# Altium project ZYNQ-HS-DEV.PrjPcb (part 1 of 4)
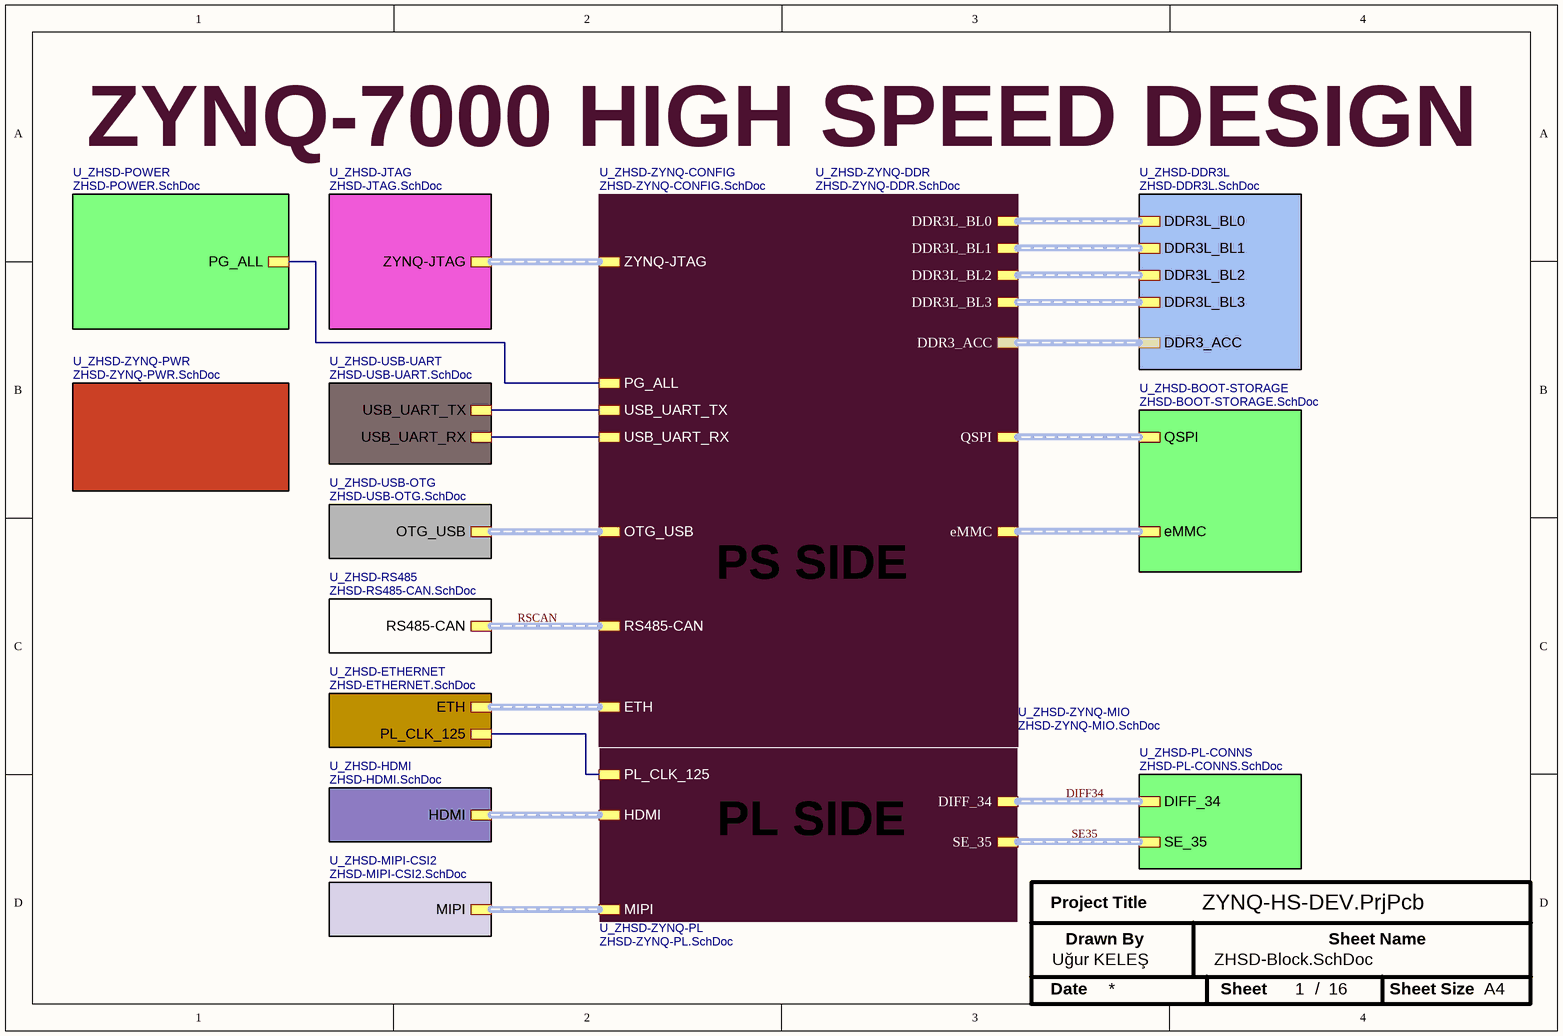
[diagram p0: ZHSD-Block.SchDoc]
16 sheets, 533 parts. Net scope: hierarchical (ports join the sheet entries above them; power ports are global).
Board file: ZYNQ-HS-DEV-PCB.PcbDoc
Sheets:
  ZHSD-Block.SchDoc
    U_ZHSD-ZYNQ-CONFIG = ZHSD-ZYNQ-CONFIG.SchDoc
    U_ZHSD-JTAG = ZHSD-JTAG.SchDoc
    U_ZHSD-ZYNQ-PWR = ZHSD-ZYNQ-PWR.SchDoc
    U_ZHSD-BOOT-STORAGE = ZHSD-BOOT-STORAGE.SchDoc
    U_ZHSD-ZYNQ-MIO = ZHSD-ZYNQ-MIO.SchDoc
    U_ZHSD-USB-OTG = ZHSD-USB-OTG.SchDoc
    U_ZHSD-ETHERNET = ZHSD-ETHERNET.SchDoc
    U_ZHSD-USB-UART = ZHSD-USB-UART.SchDoc
    U_ZHSD-RS485 = ZHSD-RS485-CAN.SchDoc
    U_ZHSD-ZYNQ-PL = ZHSD-ZYNQ-PL.SchDoc
    U_ZHSD-HDMI = ZHSD-HDMI.SchDoc
    U_ZHSD-ZYNQ-DDR = ZHSD-ZYNQ-DDR.SchDoc
    U_ZHSD-DDR3L = ZHSD-DDR3L.SchDoc
    U_ZHSD-POWER = ZHSD-POWER.SchDoc
    U_ZHSD-PL-CONNS = ZHSD-PL-CONNS.SchDoc

## Sheet ZHSD-Block.SchDoc
size A4; DrawnBy: UGUR KELES; DocumentNumber: 2; SheetNumber: 1; SheetTotal: 16; Size: A4

### Sub-sheets
U_ZHSD-BOOT-STORAGE = ZHSD-BOOT-STORAGE.SchDoc: QSPI (harness QSPI), eMMC (harness eMMC)
U_ZHSD-DDR3L = ZHSD-DDR3L.SchDoc: DDR3_ACC (harness DDR3_ACC), DDR3L_BL0 (harness DDR_H_BL0), DDR3L_BL1 (harness DDR_H_BL1), DDR3L_BL2 (harness DDR_H_BL2), DDR3L_BL3 (harness DDR_H_BL3)
U_ZHSD-ETHERNET = ZHSD-ETHERNET.SchDoc: ETH (harness ETH), PL_CLK_125
U_ZHSD-HDMI = ZHSD-HDMI.SchDoc: HDMI (harness HDMI)
U_ZHSD-JTAG = ZHSD-JTAG.SchDoc: ZYNQ-JTAG (harness JTAG)
U_ZHSD-MIPI-CSI2 = ZHSD-MIPI-CSI2.SchDoc (file not in this document): MIPI (harness MIPI)
U_ZHSD-PL-CONNS = ZHSD-PL-CONNS.SchDoc: DIFF_34 (harness PL34_DIFF), SE_35 (harness PL35_SE)
U_ZHSD-POWER = ZHSD-POWER.SchDoc: PG_ALL
U_ZHSD-RS485 = ZHSD-RS485-CAN.SchDoc: RS485-CAN (harness RS485-CAN)
U_ZHSD-USB-OTG = ZHSD-USB-OTG.SchDoc: OTG_USB (harness OTG)
U_ZHSD-USB-UART = ZHSD-USB-UART.SchDoc: USB_UART_TX, USB_UART_RX
U_ZHSD-ZYNQ-CONFIG = ZHSD-ZYNQ-CONFIG.SchDoc: ZYNQ-JTAG (harness JTAG)
U_ZHSD-ZYNQ-DDR = ZHSD-ZYNQ-DDR.SchDoc: DDR3L_BL0 (harness DDR_H_BL0), DDR3_ACC (harness DDR3_ACC), DDR3L_BL1 (harness DDR_H_BL1), DDR3L_BL2 (harness DDR_H_BL2), DDR3L_BL3 (harness DDR_H_BL3)
U_ZHSD-ZYNQ-MIO = ZHSD-ZYNQ-MIO.SchDoc: QSPI (harness QSPI), eMMC (harness eMMC), OTG_USB (harness OTG), ETH (harness ETH), USB_UART_TX, USB_UART_RX, RS485-CAN (harness RS485-CAN), PG_ALL
U_ZHSD-ZYNQ-PL = ZHSD-ZYNQ-PL.SchDoc: HDMI (harness HDMI), MIPI (harness MIPI), PL_CLK_125, DIFF_34 (harness PL34_DIFF), SE_35 (harness PL35_SE)
U_ZHSD-ZYNQ-PWR = ZHSD-ZYNQ-PWR.SchDoc: no entries

### Nets
3V3_PG: sheet U_ZHSD-ZYNQ-MIO/PG_ALL, sheet U_ZHSD-POWER/PG_ALL
PL_CLK_125: sheet U_ZHSD-ETHERNET/PL_CLK_125, sheet U_ZHSD-ZYNQ-PL/PL_CLK_125
USB_UART_RX: sheet U_ZHSD-ZYNQ-MIO/USB_UART_RX, sheet U_ZHSD-USB-UART/USB_UART_RX
USB_UART_TX: sheet U_ZHSD-ZYNQ-MIO/USB_UART_TX, sheet U_ZHSD-USB-UART/USB_UART_TX

### Buses and harness runs
harness DIFF34 = sheet U_ZHSD-PL-CONNS/DIFF_34 = sheet U_ZHSD-ZYNQ-PL/DIFF_34
harness RSCAN = sheet U_ZHSD-RS485/RS485-CAN = sheet U_ZHSD-ZYNQ-MIO/RS485-CAN
harness SE35 = sheet U_ZHSD-PL-CONNS/SE_35 = sheet U_ZHSD-ZYNQ-PL/SE_35
harness sheet U_ZHSD-BOOT-STORAGE/eMMC = sheet U_ZHSD-ZYNQ-MIO/eMMC
harness sheet U_ZHSD-BOOT-STORAGE/QSPI = sheet U_ZHSD-ZYNQ-MIO/QSPI
harness sheet U_ZHSD-DDR3L/DDR3_ACC = sheet U_ZHSD-ZYNQ-DDR/DDR3_ACC
harness sheet U_ZHSD-DDR3L/DDR3L_BL0 = sheet U_ZHSD-ZYNQ-DDR/DDR3L_BL0
harness sheet U_ZHSD-DDR3L/DDR3L_BL1 = sheet U_ZHSD-ZYNQ-DDR/DDR3L_BL1
harness sheet U_ZHSD-DDR3L/DDR3L_BL2 = sheet U_ZHSD-ZYNQ-DDR/DDR3L_BL2
harness sheet U_ZHSD-DDR3L/DDR3L_BL3 = sheet U_ZHSD-ZYNQ-DDR/DDR3L_BL3
harness sheet U_ZHSD-ETHERNET/ETH = sheet U_ZHSD-ZYNQ-MIO/ETH
harness sheet U_ZHSD-HDMI/HDMI = sheet U_ZHSD-ZYNQ-PL/HDMI
harness sheet U_ZHSD-JTAG/ZYNQ-JTAG = sheet U_ZHSD-ZYNQ-CONFIG/ZYNQ-JTAG
harness sheet U_ZHSD-MIPI-CSI2/MIPI = sheet U_ZHSD-ZYNQ-PL/MIPI
harness sheet U_ZHSD-USB-OTG/OTG_USB = sheet U_ZHSD-ZYNQ-MIO/OTG_USB

### Notes on the sheet
- ZYNQ-7000 HIGH SPEED DESIGN
- PS SIDE
- PL SIDE
- Project Title
- Uğur KELEŞ
- Drawn By
- Sheet Name
- Date
- Sheet
- /
- Sheet Size
- A4

## Sheet ZHSD-ZYNQ-CONFIG.SchDoc
size A4; DocumentNumber: 4; SheetNumber: 4; SheetTotal: 17; Size: A4
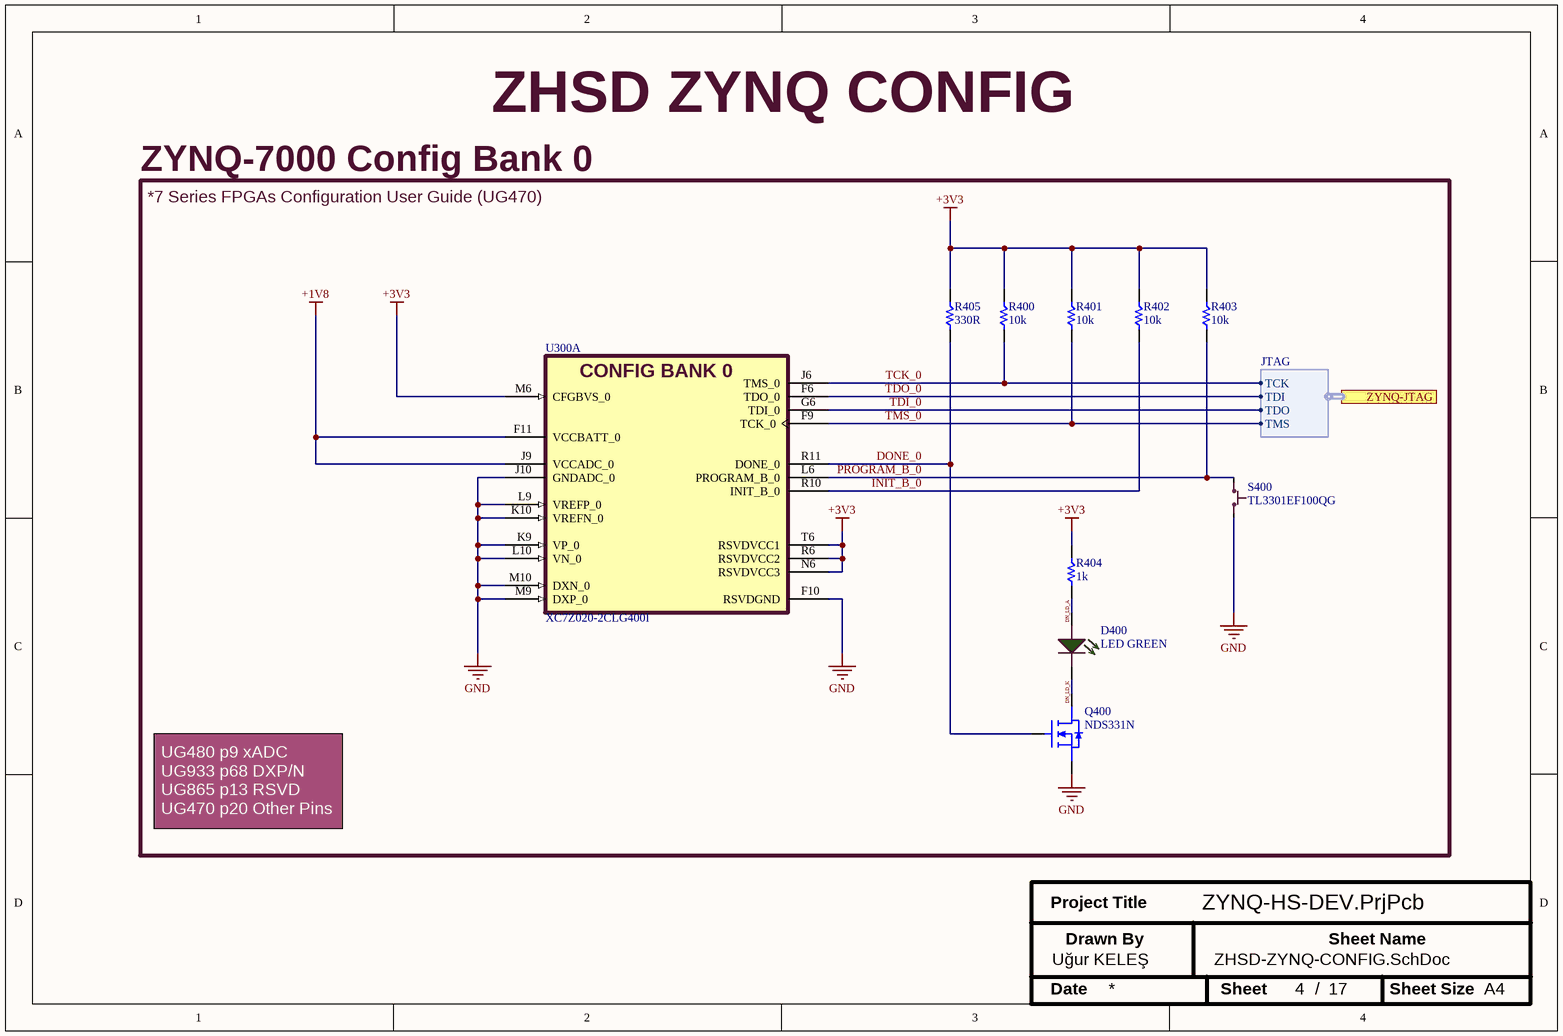
[diagram p1: ZHSD-ZYNQ-CONFIG.SchDoc]

### Parts
D400  LED GREEN  [0603_LED_1608N]
Q400  NDS331N  [SOT95P251X112-3N]
R400  10k  [0603RESC1608X05N]
R401  10k  [0603RESC1608X05N]
R402  10k  [0603RESC1608X05N]
R403  10k  [0603RESC1608X05N]
R404  1k  [0402RESC1005X04N]
R405  330R  [0603RESC1608X05N]
S400  TL3301EF100QG  [TL3301_Tact_SW]
U300  XC7Z020-2CLG400I  [BGA400C80P20X20_1700X1700X147]  (part A of 8)

### Ports
ZYNQ-JTAG (harness JTAG, see ZHSD-Block[4400,5700], ZHSD-JTAG[9300,4400])

### Harnesses
JTAG: TCK, TDI, TDO, TMS

### Nets
+1V8: U300.F11(VCCBATT_0) U300.J9(VCCADC_0)
+3V3: R400.2 R401.2 R402.2 R403.2 R404.2 R405.2 U300.M6(CFGBVS_0) U300.N6(RSVDVCC3) U300.R6(RSVDVCC2) U300.T6(RSVDVCC1)
GND: Q400.2(S) S400.1,2 U300.F10(RSVDGND) U300.J10(GNDADC_0) U300.K9(VP_0) U300.K10(VREFN_0) U300.L9(VREFP_0) U300.L10(VN_0) U300.M9(DXP_0) U300.M10(DXN_0)
DN_LD_A: D400.1(A) R404.1
DN_LD_K: D400.2(C) Q400.3(D)
DONE_0: Q400.1(G) R405.1 U300.R11(DONE_0)
INIT_B_0: R402.1 U300.R10(INIT_B_0)
PROGRAM_B_0: R403.1 S400.3,4 U300.L6(PROGRAM_B_0)
TCK_0: R400.1 U300.J6(TMS_0) ; port ZYNQ-JTAG.TCK
TDI_0: U300.G6(TDI_0) ; port ZYNQ-JTAG.TDO
TDO_0: U300.F6(TDO_0) ; port ZYNQ-JTAG.TDI
TMS_0: R401.1 U300.F9(TCK_0) ; port ZYNQ-JTAG.TMS

### Notes on the sheet
- ZYNQ-7000 Config Bank 0
- ZHSD ZYNQ CONFIG
- *7 Series FPGAs Configuration User Guide (UG470)
- UG480 p9 xADC
  UG933 p68 DXP/N
  UG865 p13 RSVD
  UG470 p20 Other Pins
- Project Title
- Uğur KELEŞ
- Drawn By
- Sheet Name
- Date
- Sheet
- /
- Sheet Size
- A4
- (in symbol XC7Z020-2CLG400I, part A) CONFIG BANK 0

### Library data of the parts
D400 = LTST-C191TGKT: LED GREEN CLEAR CHIP SMD; Manufacturer: Lite-On Inc.; ComponentLink1Description: Datasheet; ComponentLink1URL: https://optoelectronics.liteon.com/upload/download/DS22-2000-300/LTST-C191TGKT.PDF; MPN: LTST-C191TGKT; Package: 0603
Q400 = NDS331N: N-Channel 20 V 1.3A (Ta) 500mW (Ta) Surface Mount SOT-23-3; Manufacturer: onsemi; Drain to Source Voltage (Vdss): 20 V; Rds On (Max) @ Id, Vgs: 160mOhm @ 1.5A, 4.5V; Vgs (Max): ±8V; ComponentLink1Description: Datasheet; ComponentLink1URL: https://www.onsemi.com/pdf/datasheet/nds331n-d.pdf; MPN: NDS331N; Package: SOT-23-3
R400-R403 = RC0603FR-0710KL: RES 10K OHM 1% 1/10W 0603(1608); Manufacturer: YAGEO; Value: 10 kOhms; Voltage: 75V; ComponentLink1Description: Datasheet; ComponentLink1URL: https://yageogroup.com/content/datasheet/asset/file/PYU-RC_GROUP_51_ROHS_L; MPN: RC0603FR-0710KL; Tolerance: ±1%; Package: 0603
R404 = RC0402JR-071KL: RES 1K OHM 5% 1/16W 0402 (1005); Manufacturer: YAGEO; Value: 1 kOhms; Voltage: 50V; ComponentLink1Description: Datasheet; ComponentLink1URL: https://yageogroup.com/content/datasheet/asset/file/PYU-RT_1-TO-0-01_ROHS_L; MPN: RC0402JR-071KL; Tolerance: ±5%; Package: 0402
R405 = RC0603FR-07330RL: RES 330 OHM 1% 1/10W 0603(1608); Manufacturer: YAGEO; Value: 330 Ohms; Voltage: 75V; ComponentLink1Description: Datasheet; ComponentLink1URL: https://yageogroup.com/content/datasheet/asset/file/PYU-RC_GROUP_51_ROHS_L; MPN: RC0603FR-07330RL; Tolerance: ±1%; Package: 0603
S400 = TL3301EF100QG: SWITCH TACTILE SPST-NO 0.05A 12V; pin to pad: 1,2>1+2 3,4>3+4; Manufacturer: E-Switch; ComponentLink1Description: Datasheet; ComponentLink1URL: https://configured-product-images.s3.amazonaws.com/Datasheets/TL3301.pdf; MPN: TL3301EF100QG
U300 = XC7Z020-2CLG400I: Dual ARM® Cortex®-A9 MPCore™ with CoreSight™ System On Chip (SOC) IC Zynq®-7000 Artix™-7 FPGA, 85K Logic Cells 766MHz 400-CSPBGA (17x17); Manufacturer: AMD/XILINX; MPN: XC7Z020-2CLG400I; ComponentLink1Description: Datasheet; ComponentLink1URL: https://docs.amd.com/v/u/en-US/ds190-Zynq-7000-Overview; ComponentLink2Description: DC and AC Switching Characteristics; ComponentLink2URL: https://docs.amd.com/v/u/en-US/ds187-XC7Z010-XC7Z020-Data-Sheet; ComponentLink3Description: PCB Design Guide; ComponentLink3URL: https://docs.amd.com/v/u/en-US/ug933-Zynq-7000-PCB; ComponentLink4Description: Packaging and Pinout; ComponentLink4URL: https://docs.amd.com/v/u/en-US/ug865-Zynq-7000-Pkg-Pinout; ComponentLink5Description: Zynq 7000 SoC Technical Reference Manual; ComponentLink5URL: https://docs.amd.com/r/en-US/ug585-zynq-7000-SoC-TRM

## Sheet ZHSD-JTAG.SchDoc
size A4; DocumentNumber: 5; SheetNumber: 5; SheetTotal: 16; Size: A4
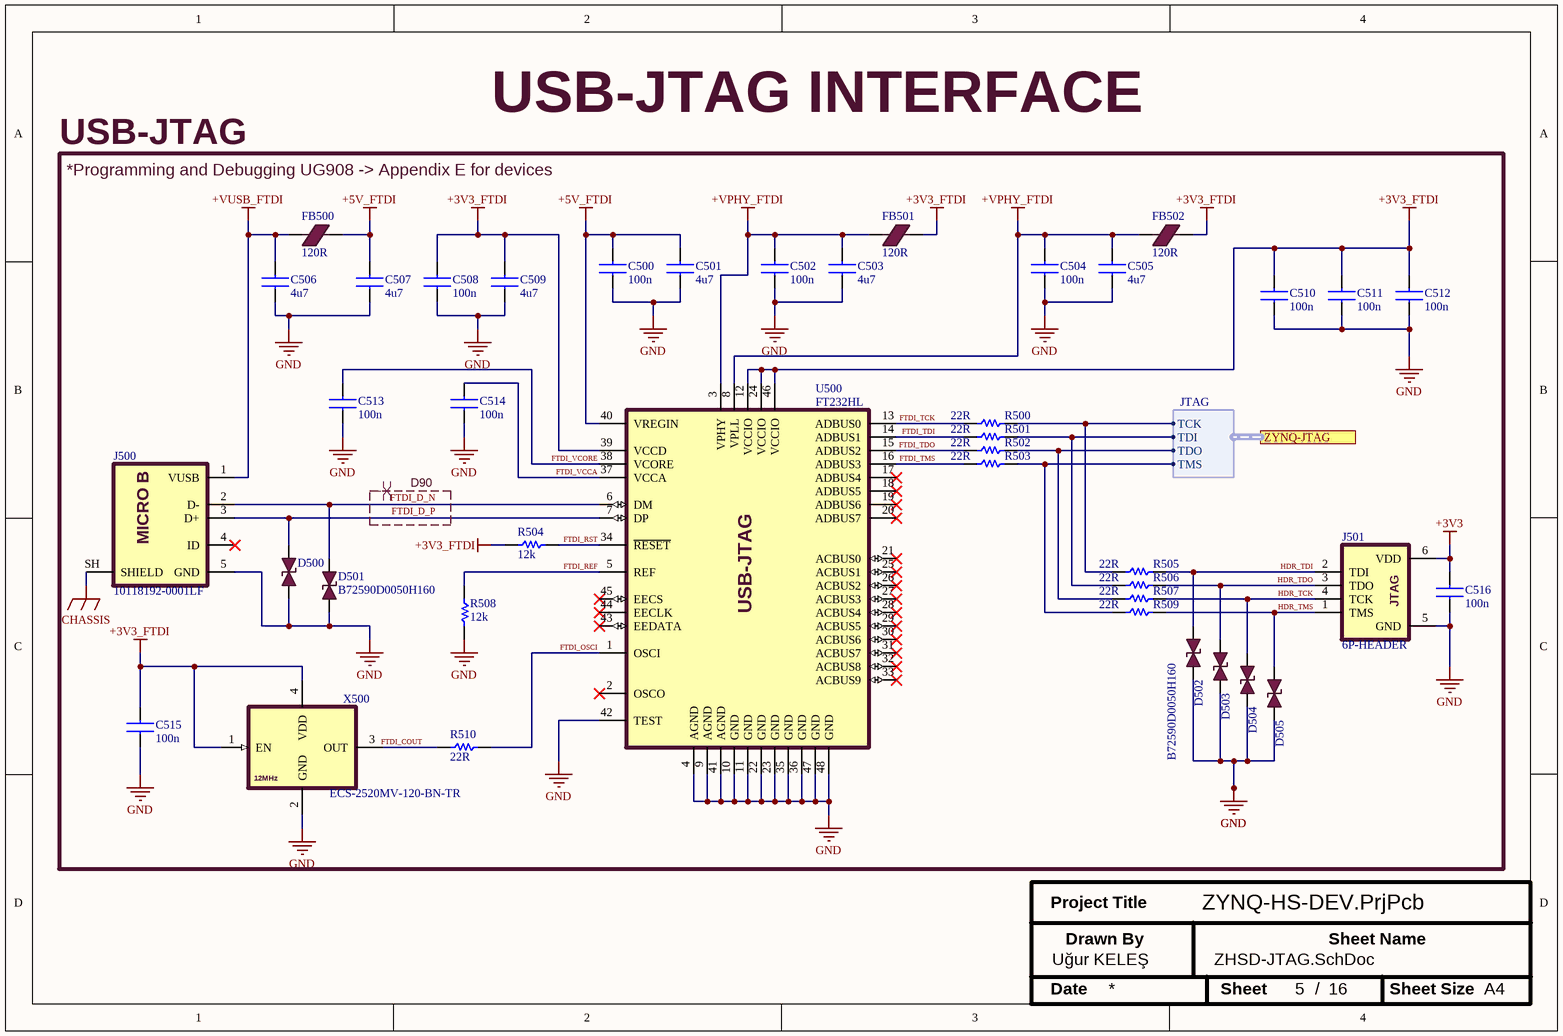
[diagram p2: ZHSD-JTAG.SchDoc]

### Parts
C500  100n  [0603CAPC1608X09N]
C501  4u7  [0603CAPC1608X09N]
C502  100n  [0603CAPC1608X09N]
C503  4u7  [0603CAPC1608X09N]
C504  100n  [0603CAPC1608X09N]
C505  4u7  [0603CAPC1608X09N]
C506  4u7  [0603CAPC1608X09N]
C507  4u7  [0603CAPC1608X09N]
C508  100n  [0603CAPC1608X09N]
C509  4u7  [0603CAPC1608X09N]
C510  100n  [0603CAPC1608X09N]
C511  100n  [0603CAPC1608X09N]
C512  100n  [0603CAPC1608X09N]
C513  100n  [0603CAPC1608X09N]
C514  100n  [0603CAPC1608X09N]
C515  100n  [0603CAPC1608X09N]
C516  100n  [0603CAPC1608X09N]
D500  B72590D0050H160  [0402DIOC1005X06N]  (value not drawn)
D501  B72590D0050H160  [0402DIOC1005X06N]
D502  B72590D0050H160  [0402DIOC1005X06N]  (value not drawn)
D503  B72590D0050H160  [0402DIOC1005X06N]  (value not drawn)
D504  B72590D0050H160  [0402DIOC1005X06N]  (value not drawn)
D505  B72590D0050H160  [0402DIOC1005X06N]
FB500  120R  [0603INDC1608X08N]
FB501  120R  [0603INDC1608X08N]
FB502  120R  [0603INDC1608X08N]
J500  10118192-0001LF  [USB2.0 MICRO B SMD]
J501  6P-HEADER  [CONN-6P-HEADER]
R500  22R  [0603RESC1608X05N]
R501  22R  [0603RESC1608X05N]
R502  22R  [0603RESC1608X05N]
R503  22R  [0603RESC1608X05N]
R504  12k  [0603RESC1608X05N]
R505  22R  [0603RESC1608X05N]
R506  22R  [0603RESC1608X05N]
R507  22R  [0603RESC1608X05N]
R508  12k  [0603RESC1608X05N]
R509  22R  [0603RESC1608X05N]
R510  22R  [0603RESC1608X05N]
U500  FT232HL  [LQFP50P900X900X160-48N]
X500  ECS-2520MV-120-BN-TR  [XTAL_2520]

### Ports
ZYNQ-JTAG (harness JTAG, see ZHSD-Block[3600,5700], ZHSD-ZYNQ-CONFIG[9900,4700])

### Harnesses
JTAG: TCK, TDI, TDO, TMS

### Nets
+3V3: C516.2 J501.6(VDD)
+3V3_FTDI: C508.2 C509.2 C510.2 C511.2 C512.2 C515.2 FB501.2 FB502.2 R504.1 U500.12(VCCIO) U500.24(VCCIO) U500.39(VCCD) U500.46(VCCIO) X500.1(EN) X500.4(VDD)
+5V_FTDI: C500.2 C501.2 C507.2 FB500.2 U500.40(VREGIN)
+VPHY_FTDI: C502.2 C503.2 C504.2 C505.2 FB501.1 FB502.1 U500.3(VPHY) U500.8(VPLL)
+VUSB_FTDI: C506.2 FB500.1 J500.1(VUSB)
CHASSIS: J500.SH(SHIELD)
GND: C500.1 C501.1 C502.1 C503.1 C504.1 C505.1 C506.1 C507.1 C508.1 C509.1 C510.1 C511.1 C512.1 C513.1 C514.1 C515.1 C516.1 D500.1 D501.1 D502.1 D503.1 D504.1 D505.1 J500.5(GND) J501.5(GND) R508.2 U500.4(AGND) U500.9(AGND) U500.10(GND) U500.11(GND) U500.22(GND) U500.23(GND) U500.35(GND) U500.36(GND) U500.41(AGND) U500.42(TEST) U500.47(GND) U500.48(GND) X500.2(GND)
FTDI_COUT: R510.1 X500.3(OUT)
FTDI_D_N: D501.2 J500.2(D-) U500.6(DM)
FTDI_D_P: D500.2 J500.3(D+) U500.7(DP)
FTDI_OSCI: R510.2 U500.1(OSCI)
FTDI_REF: R508.1 U500.5(REF)
FTDI_RST: R504.2 U500.34(~{RESET})
FTDI_TCK: R500.1 U500.13(ADBUS0)
FTDI_TDI: R501.1 U500.14(ADBUS1)
FTDI_TDO: R502.1 U500.15(ADBUS2)
FTDI_TMS: R503.1 U500.16(ADBUS3)
FTDI_VCCA: C514.2 U500.37(VCCA)
FTDI_VCORE: C513.2 U500.38(VCORE)
HDR_TCK: D504.2 J501.4(TCK) R507.2
HDR_TDI: D502.2 J501.2(TDI) R505.2
HDR_TDO: D503.2 J501.3(TDO) R506.2
HDR_TMS: D505.2 J501.1(TMS) R509.2
TCK_0: R500.2 R505.1 ; port ZYNQ-JTAG.TCK
TDI_0: R502.2 R507.1 ; port ZYNQ-JTAG.TDO
TDO_0: R501.2 R506.1 ; port ZYNQ-JTAG.TDI
TMS_0: R503.2 R509.1 ; port ZYNQ-JTAG.TMS

Not connected (* = marked no-connect by the designer): J500 4(ID)*; U500 2(OSCO)* 17(ADBUS4)* 18(ADBUS5)* 19(ADBUS6)* 20(ADBUS7)* 21(ACBUS0)* 25(ACBUS1)* 26(ACBUS2)* 27(ACBUS3)* 28(ACBUS4)* 29(ACBUS5)* 30(ACBUS6)* 31(ACBUS7)* 32(ACBUS8)* 33(ACBUS9)* 43(EEDATA)* 44(EECLK)* 45(EECS)*

### Layout directives
differential pair; differential pair class USB; rule Differential Pairs Routing [Pref Gap = 6.299mil    Min Gap  = 5mil    Max Gap  = 7.874milPref Width = 3.937mil    Min Width  = 3.937mil    Max Width  = 4.768mil]; Impedance: D90: FTDI_D_N, FTDI_D_P

### Notes on the sheet
- USB-JTAG
- *Programming and Debugging UG908 -> Appendix E for devices
- USB-JTAG INTERFACE
- Project Title
- Uğur KELEŞ
- Drawn By
- Sheet Name
- Date
- Sheet
- /
- Sheet Size
- A4
- (in symbol ECS-2520MV-120-BN-TR) 12MHz
- (in symbol FT232HL) USB-JTAG
- (in symbol JTAG-HEADER) JTAG
- (in symbol USB-MICRO-B) MICRO B

### Library data of the parts
C500 C502 C504 C508 C510-C516 = GRM155R71C104KA88J: CAP CER 0.1UF 16V X7R 0402 (1005) ±10%; Manufacturer: Murata Electronics; Value: 0.1 µF; ComponentLink1Description: Datasheet; ComponentLink1URL: https://search.murata.co.jp/Ceramy/image/img/A01X/G101/ENG/GRM155R71C104KA88-01.pdf; MPN: GRM155R71C104KA88J; Package: 0402; Tolerance: ±10%; Voltage: 16V
C501 C503 C505-C507 C509 = CL10A475KP8NNNC: CAP CER 4.7UF 10V X5R 0603 (1608) ±10%; Manufacturer: Samsung Electro-Mechanics; Value: 4.7 µF; ComponentLink1Description: Datasheet; ComponentLink1URL: https://mm.digikey.com/Volume0/opasdata/d220001/medias/docus/609/CL10A475KP8NNNC_Spec.pdf; MPN: CL10A475KP8NNNC; Package: 0603; Tolerance: ±10%; Voltage: 10V
D500-D505 = B72590D0050H160: Varistor 1 Circuit Surface Mount, MLCV 0402 (1005 Metric); Manufacturer: EPCOS - TDK Electronics; ComponentLink1Description: Datasheet; ComponentLink1URL: https://www.tdk-electronics.tdk.com/inf/75/ds/High_speed_series.pdf?ref_disty=digikey; MPN: B72590D0050H160; Package: 0402
FB500-FB502 = BLM18SG121TN1D: FERRITE BEAD 120 OHM 0603 (1608) 3A 25mOhm; Manufacturer: Murata Electronics; Impedance @ Frequency: 120 Ohms @ 100 MHz; ComponentLink1Description: Datasheet; ComponentLink1URL: https://pim.murata.com/asset/pim4/ferriteBeadInductortypefilter/ENFA0003_PDF_FERRITEBEADINDUCTORTYPEFILTER?lastModifiedDatetime=20250707190934; ComponentLink2Description: Website; ComponentLink2URL: https://pim.murata.com/en-global/pim/details/?partNum=BLM18SG121TN1%23; Current Rating (Max): 3A; DC Resistance (DCR) (Max): 25mOhm; MPN: BLM18SG121TN1D; Package: 0603
J500 = USB-MICRO-B: CONN RCPT USB2.0 MICRO B SMD R/A; Manufacturer: Amphenol ICC (FCI); ComponentLink1Description: Datasheet; ComponentLink1URL: https://cdn.amphenol-cs.com/media/wysiwyg/files/documentation/datasheet/inputoutput/io_usb_micro.pdf; MPN: 10118192-0001LF
J501 = JTAG-HEADER: JTAG CONN HEADER VERT 6POS 2.54MM
R500-R503 R505-R507 R509 R510 = RC0603FR-0722RL: RES 22 OHM 1% 1/10W 0603 (1608); Manufacturer: YAGEO; Value: 22 Ohms; Voltage: 75V; ComponentLink1Description: Datasheet; ComponentLink1URL: https://yageogroup.com/content/datasheet/asset/file/PYU-RC_GROUP_51_ROHS_L; MPN: RC0603FR-0722RL; Tolerance: ±1%; Package: 0603
R504 R508 = RC0603FR-0712KL: RES 12K OHM 1% 1/10W 0603 (1608); Manufacturer: YAGEO; Value: 12 kOhms; Voltage: 75V; ComponentLink1Description: Datasheet; ComponentLink1URL: https://yageogroup.com/content/datasheet/asset/file/PYU-RC_GROUP_51_ROHS_L; MPN: RC0603FR-0712KL; Tolerance: ±1%; Package: 0603
U500 = FT232HL: USB Bridge, USB to UART (JTAG),FIFO USB 2.0 UART, FIFO Interface 48-LQFP (7x7); Manufacturer: FTDI, Future Technology Devices International Ltd; MPN: FT232HL-REEL; ComponentLink1Description: Datasheet; ComponentLink1URL: https://ftdichip.com/wp-content/uploads/2024/09/DS_FT232H.pdf#page=51&zoom=100,72,126
X500 = ECS-2520MV-120-BN-TR: XTAL OSC XO 12.0000MHZ CMOS SMD; Manufacturer: ECS Inc.; ComponentLink1Description: Datasheet; ComponentLink1URL: https://ecsxtal.com/store/pdf/ECS-2520MV.pdf; MPN: ECS-2520MV-120-BN-TR

## Sheet ZHSD-ZYNQ-PWR.SchDoc
size A3; DocumentNumber: 3; SheetNumber: 3; SheetTotal: 17; Size: A3
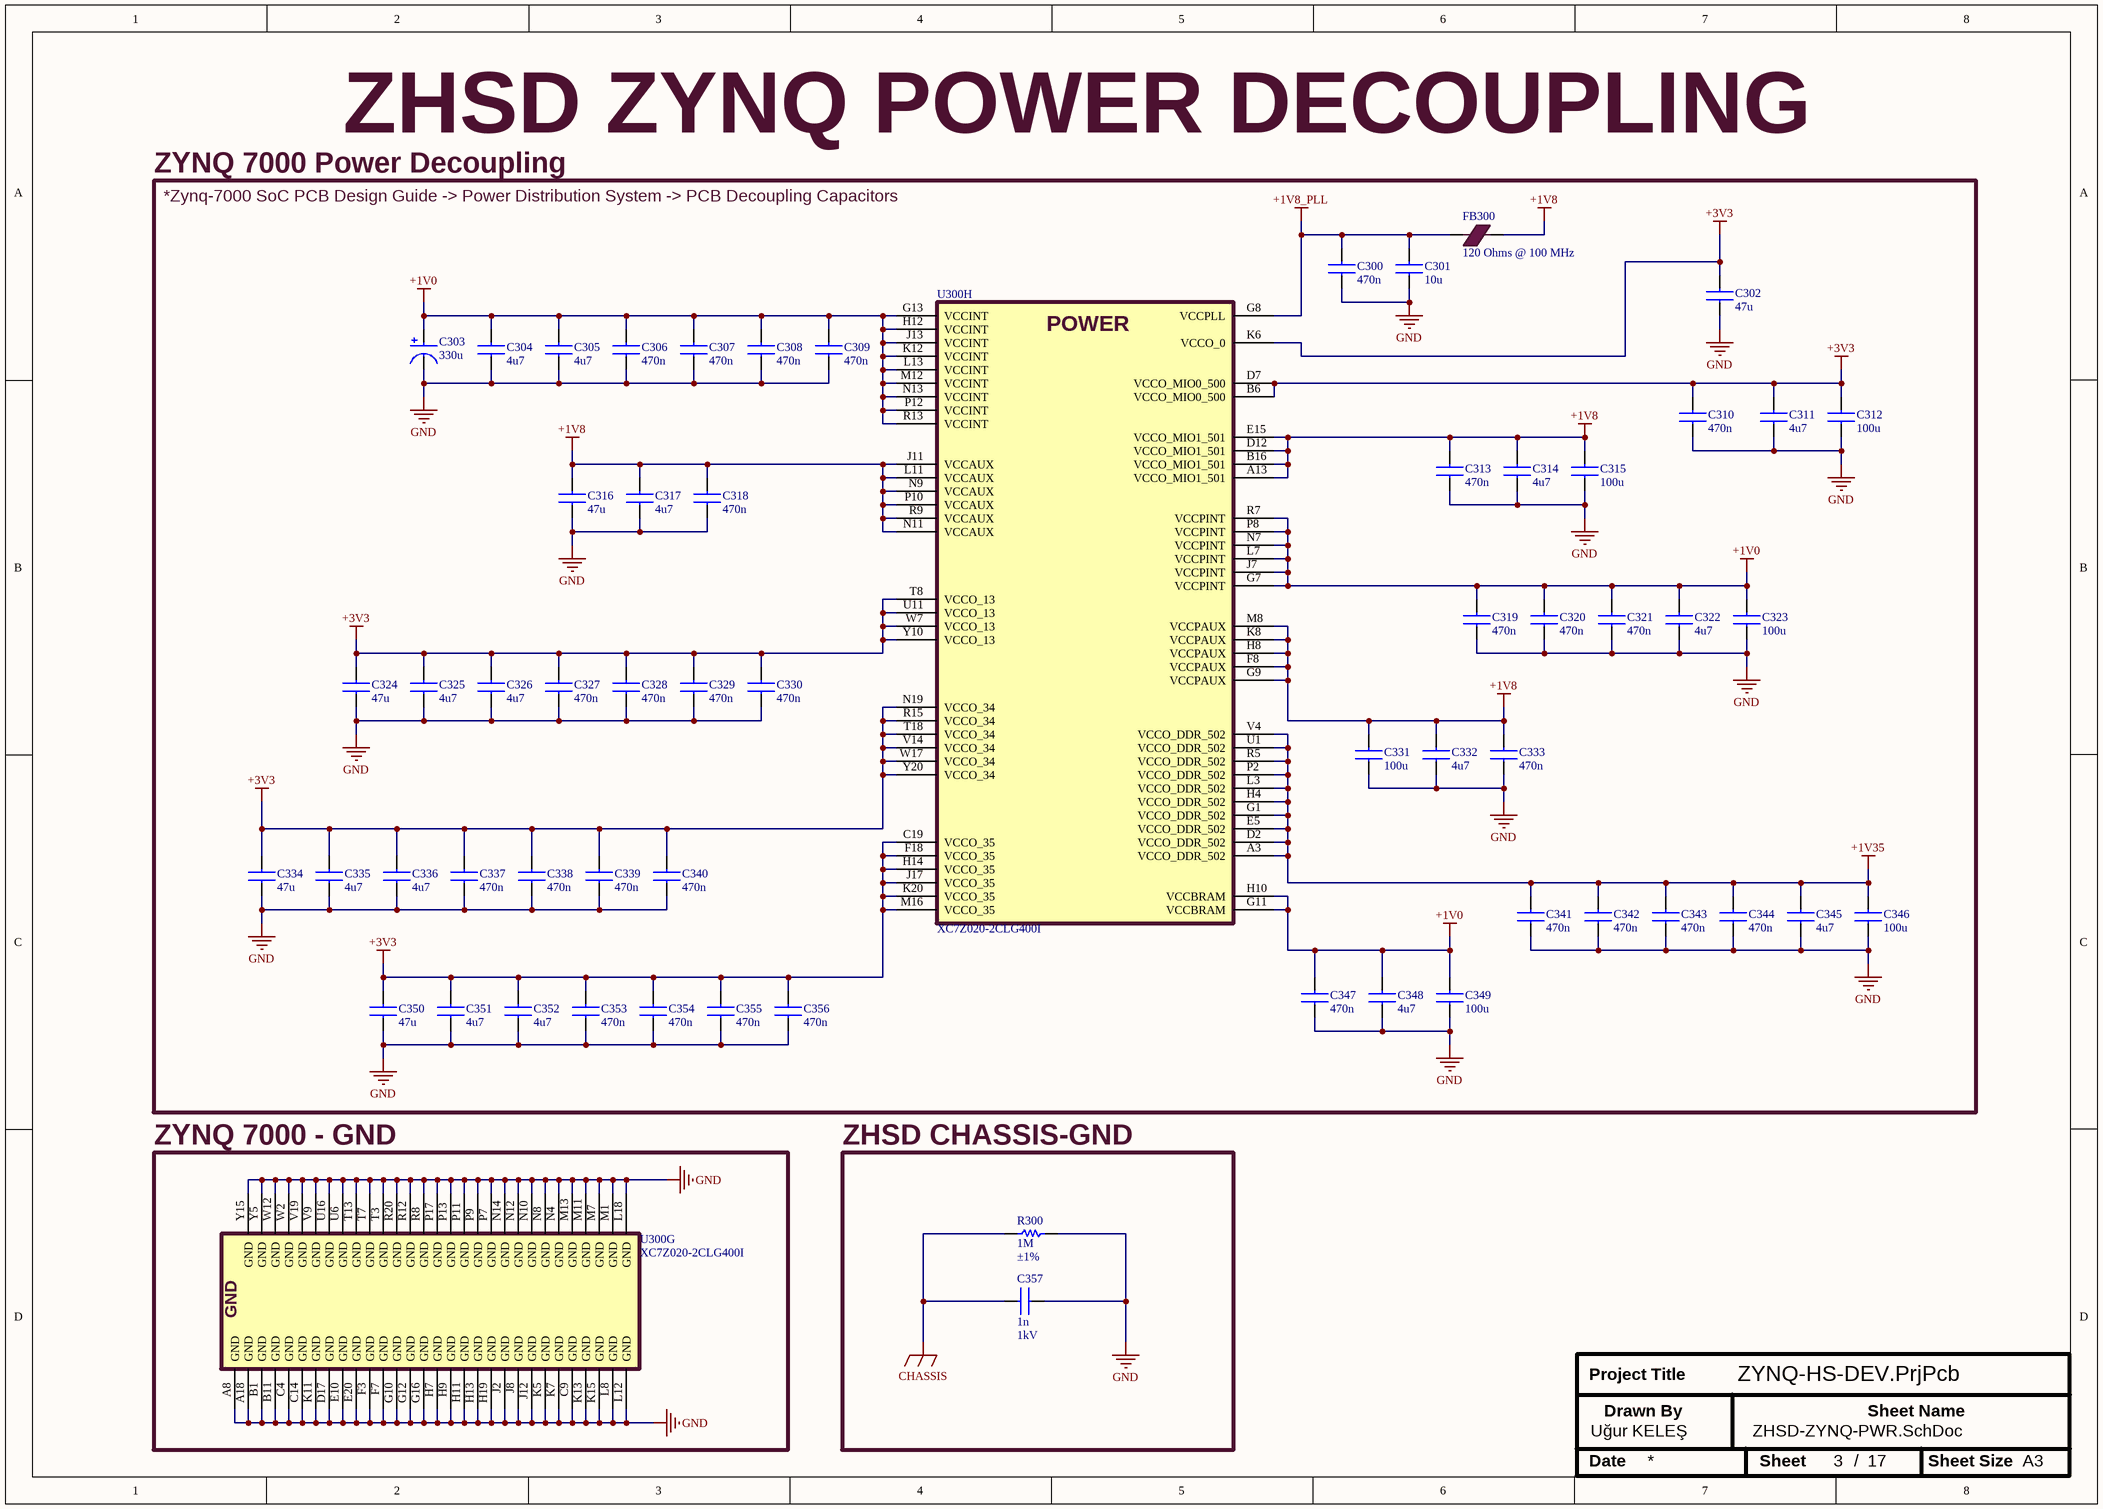
[diagram p3: ZHSD-ZYNQ-PWR.SchDoc]

### Parts
C300  470n  [0402CAPC1005X06N]
C301  10u  [0603CAPC1608X09N]
C302  47u  [1210CAPC3225X27N]
C303  330u  [T525D337M006ATE025]
C304  4u7  [0603CAPC1608X09N]
C305  4u7  [0603CAPC1608X09N]
C306  470n  [0402CAPC1005X06N]
C307  470n  [0402CAPC1005X06N]
C308  470n  [0402CAPC1005X06N]
C309  470n  [0402CAPC1005X06N]
C310  470n  [0402CAPC1005X06N]
C311  4u7  [0603CAPC1608X09N]
C312  100u  [1210CAPC3225X27N]
C313  470n  [0402CAPC1005X06N]
C314  4u7  [0603CAPC1608X09N]
C315  100u  [1210CAPC3225X27N]
C316  47u  [1210CAPC3225X27N]
C317  4u7  [0603CAPC1608X09N]
C318  470n  [0402CAPC1005X06N]
C319  470n  [0402CAPC1005X06N]
C320  470n  [0402CAPC1005X06N]
C321  470n  [0402CAPC1005X06N]
C322  4u7  [0603CAPC1608X09N]
C323  100u  [1210CAPC3225X27N]
C324  47u  [1210CAPC3225X27N]
C325  4u7  [0603CAPC1608X09N]
C326  4u7  [0603CAPC1608X09N]
C327  470n  [0402CAPC1005X06N]
C328  470n  [0402CAPC1005X06N]
C329  470n  [0402CAPC1005X06N]
C330  470n  [0402CAPC1005X06N]
C331  100u  [1210CAPC3225X27N]
C332  4u7  [0603CAPC1608X09N]
C333  470n  [0402CAPC1005X06N]
C334  47u  [1210CAPC3225X27N]
C335  4u7  [0603CAPC1608X09N]
C336  4u7  [0603CAPC1608X09N]
C337  470n  [0402CAPC1005X06N]
C338  470n  [0402CAPC1005X06N]
C339  470n  [0402CAPC1005X06N]
C340  470n  [0402CAPC1005X06N]
C341  470n  [0402CAPC1005X06N]
C342  470n  [0402CAPC1005X06N]
C343  470n  [0402CAPC1005X06N]
C344  470n  [0402CAPC1005X06N]
C345  4u7  [0603CAPC1608X09N]
C346  100u  [1210CAPC3225X27N]
C347  470n  [0402CAPC1005X06N]
C348  4u7  [0603CAPC1608X09N]
C349  100u  [1210CAPC3225X27N]
C350  47u  [1210CAPC3225X27N]
C351  4u7  [0603CAPC1608X09N]
C352  4u7  [0603CAPC1608X09N]
C353  470n  [0402CAPC1005X06N]
C354  470n  [0402CAPC1005X06N]
C355  470n  [0402CAPC1005X06N]
C356  470n  [0402CAPC1005X06N]
C357  1n  Voltage: 1kV  [0805CAPC2012X14N]
FB300  120 Ohms @ 100 MHz  [0603INDC1608X08N]
R300  1M  Tolerance: ±1%  [0603RESC1608X05N]
U300  XC7Z020-2CLG400I  [BGA400C80P20X20_1700X1700X147]  (parts G,H of 8)

### Blocks framed on the sheet
ZYNQ 7000 Power Decoupling: C300-C356 FB300 U300
ZYNQ 7000 - GND: U300
ZHSD CHASSIS-GND: C357 R300

### Nets
+1V0: C303.1 C304.2 C305.2 C306.2 C307.2 C308.2 C309.2 C319.2 C320.2 C321.2 C322.2 C323.1 C347.2 C348.2 C349.1 U300.G7(VCCPINT) U300.G11(VCCBRAM) U300.G13(VCCINT) U300.H10(VCCBRAM) U300.H12(VCCINT) U300.J7(VCCPINT) U300.J13(VCCINT) U300.K12(VCCINT) U300.L7(VCCPINT) U300.L13(VCCINT) U300.M12(VCCINT) U300.N7(VCCPINT) U300.N13(VCCINT) U300.P8(VCCPINT) U300.P12(VCCINT) U300.R7(VCCPINT) U300.R13(VCCINT)
+1V8: C313.2 C314.2 C315.1 C316.2 C317.2 C318.2 C331.1 C332.2 C333.2 FB300.2 U300.A13(VCCO_MIO1_501) U300.B16(VCCO_MIO1_501) U300.D12(VCCO_MIO1_501) U300.E15(VCCO_MIO1_501) U300.F8(VCCPAUX) U300.G9(VCCPAUX) U300.H8(VCCPAUX) U300.J11(VCCAUX) U300.K8(VCCPAUX) U300.L11(VCCAUX) U300.M8(VCCPAUX) U300.N9(VCCAUX) U300.N11(VCCAUX) U300.P10(VCCAUX) U300.R9(VCCAUX)
+1V8_PLL: C300.2 C301.2 FB300.1 U300.G8(VCCPLL)
+1V35: C341.2 C342.2 C343.2 C344.2 C345.2 C346.1 U300.A3(VCCO_DDR_502) U300.D2(VCCO_DDR_502) U300.E5(VCCO_DDR_502) U300.G1(VCCO_DDR_502) U300.H4(VCCO_DDR_502) U300.L3(VCCO_DDR_502) U300.P2(VCCO_DDR_502) U300.R5(VCCO_DDR_502) U300.U1(VCCO_DDR_502) U300.V4(VCCO_DDR_502)
+3V3: C302.2 C310.2 C311.2 C312.1 C324.2 C325.2 C326.2 C327.2 C328.2 C329.2 C330.2 C334.2 C335.2 C336.2 C337.2 C338.2 C339.2 C340.2 C350.2 C351.2 C352.2 C353.2 C354.2 C355.2 C356.2 U300.B6(VCCO_MIO0_500) U300.C19(VCCO_35) U300.D7(VCCO_MIO0_500) U300.F18(VCCO_35) U300.H14(VCCO_35) U300.J17(VCCO_35) U300.K6(VCCO_0) U300.K20(VCCO_35) U300.M16(VCCO_35) U300.N19(VCCO_34) U300.R15(VCCO_34) U300.T8(VCCO_13) U300.T18(VCCO_34) U300.U11(VCCO_13) U300.V14(VCCO_34) U300.W7(VCCO_13) U300.W17(VCCO_34) U300.Y10(VCCO_13) U300.Y20(VCCO_34)
CHASSIS: C357.2 R300.1
GND: C300.1 C301.1 C302.1 C303.2 C304.1 C305.1 C306.1 C307.1 C308.1 C309.1 C310.1 C311.1 C312.2 C313.1 C314.1 C315.2 C316.1 C317.1 C318.1 C319.1 C320.1 C321.1 C322.1 C323.2 C324.1 C325.1 C326.1 C327.1 C328.1 C329.1 C330.1 C331.2 C332.1 C333.1 C334.1 C335.1 C336.1 C337.1 C338.1 C339.1 C340.1 C341.1 C342.1 C343.1 C344.1 C345.1 C346.2 C347.1 C348.1 C349.2 C350.1 C351.1 C352.1 C353.1 C354.1 C355.1 C356.1 C357.1 R300.2 U300.A8(GND) U300.A18(GND) U300.B1(GND) U300.B11(GND) U300.C4(GND) U300.C9(GND) U300.C14(GND) U300.D17(GND) U300.E10(GND) U300.E20(GND) U300.F3(GND) U300.F7(GND) U300.G10(GND) U300.G12(GND) U300.G16(GND) U300.H7(GND) U300.H9(GND) U300.H11(GND) U300.H13(GND) U300.H19(GND) U300.J2(GND) U300.J8(GND) U300.J12(GND) U300.K5(GND) U300.K7(GND) U300.K11(GND) U300.K13(GND) U300.K15(GND) U300.L8(GND) U300.L12(GND) U300.L18(GND) U300.M1(GND) U300.M7(GND) U300.M11(GND) U300.M13(GND) U300.N4(GND) U300.N8(GND) U300.N10(GND) U300.N12(GND) U300.N14(GND) U300.P7(GND) U300.P9(GND) U300.P11(GND) U300.P13(GND) U300.P17(GND) U300.R8(GND) U300.R12(GND) U300.R20(GND) U300.T3(GND) U300.T7(GND) U300.T13(GND) U300.U6(GND) U300.U16(GND) U300.V9(GND) U300.V19(GND) U300.W2(GND) U300.W12(GND) U300.Y5(GND) U300.Y15(GND)

### Notes on the sheet
- ZHSD ZYNQ POWER DECOUPLING
- *Zynq-7000 SoC PCB Design Guide -> Power Distribution System -> PCB Decoupling Capacitors
- Project Title
- Uğur KELEŞ
- Drawn By
- Sheet Name
- Date
- Sheet
- /
- Sheet Size
- A3
- (in symbol XC7Z020-2CLG400I, part H) POWER

### Library data of the parts
C300 C306-C310 C313 C318-C321 C327-C330 C333 C337-C344 C347 C353-C356 = GRM155R60J474KE19D: CAP CER 0.47UF 6.3V X5R 0402(1005) ±10%; Manufacturer: Murata Electronics; Value: 0.47 µF; ComponentLink1Description: Datasheet; ComponentLink1URL: https://search.murata.co.jp/Ceramy/image/img/A01X/G101/ENG/GRM21BR71A475KE51-01.pdf; MPN: GRM155R60J474KE19D; Package: 0402; Tolerance: ±10%; Voltage: 6.3V
C301 = GRM188R60G106ME47D: CAP CER 10UF 4V X5R 0603 (1608) ±20%; Manufacturer: Murata Electronics; Value: 10 µF; ComponentLink1Description: Datasheet; ComponentLink1URL: https://search.murata.co.jp/Ceramy/image/img/A01X/G101/ENG/GRM188R60G106ME47-01.pdf; MPN: GRM188R60G106ME47D; Package: 0603; Tolerance: ±20%; Voltage: 4V
C302 C316 C324 C334 C350 = GRM32ER70J476ME20L: CAP CER 47UF 6.3V X7R 1210 1210 (3225) ±20%; Manufacturer: Murata Electronics; Value: 47 µF; ComponentLink1Description: Datasheet; ComponentLink1URL: https://search.murata.co.jp/Ceramy/image/img/A01X/G101/ENG/GRM32ER70J476ME20-01.pdf; MPN: GRM32ER70J476ME20L; Package: 1210; Tolerance: ±20%; Voltage: 6.3V
C303 = T525D337M006ATE025: CAP TANT POLY 330UF 6.3V 2917 (7343) ±20%; Manufacturer: KEMET; ESR: 25mOhm @ 100kHz; Value: 330 µF; ComponentLink1Description: Datasheet; ComponentLink1URL: https://search.kemet.com/download/specsheet/T525D337M006ATE025; MPN: T525D337M006ATE025; Package: 2917; Tolerance: ±20%; Voltage: 6.3 V
C304 C305 C311 C314 C317 C322 C325 C326 C332 C335 C336 C345 C348 C351 C352 = CL10A475KP8NNNC: as C501 on sheet ZHSD-JTAG; ComponentLink1Description: Datasheet; ComponentLink1URL: https://mm.digikey.com/Volume0/opasdata/d220001/medias/docus/609/CL10A475KP8NNNC_Spec.pdf; MPN: CL10A475KP8NNNC; Package: 0603; Tolerance: ±10%; Voltage: 10V
C312 C315 C323 C331 C346 C349 = GRM32EE70G107ME19L: CAP CER 100UF 4V X7U 1210 (3225) ±20%; Manufacturer: Murata Electronics; Value: 100 µF; ComponentLink1Description: Datasheet; ComponentLink1URL: https://search.murata.co.jp/Ceramy/image/img/A01X/G101/ENG/GRM32EE70G107ME19-01.pdf; MPN: GRM32EE70G107ME19L; Package: 1210; Tolerance: ±20%; Voltage: 4V
C357 = CC0805KRX7RCBB102: CAP CER 1000PF 1KV X7R 0805 (2012) ±10%; Manufacturer: YAGEO; ComponentLink1Description: Datasheet; ComponentLink1URL: https://search.murata.co.jp/Ceramy/image/img/A01X/G101/ENG/GRM21BR71A475KE51-01.pdf; MPN: CC0805KRX7RCBB102; Package: 0805; Tolerance: ±10%; Value: 1000 pF
FB300 = BLM18SG121TN1D: FERRITE BEAD 120 OHM 0603 (1608) 3A 25mOhm; Manufacturer: Murata Electronics; ComponentLink1Description: Datasheet; ComponentLink1URL: https://pim.murata.com/asset/pim4/ferriteBeadInductortypefilter/ENFA0003_PDF_FERRITEBEADINDUCTORTYPEFILTER?lastModifiedDatetime=20250707190934; ComponentLink2Description: Website; ComponentLink2URL: https://pim.murata.com/en-global/pim/details/?partNum=BLM18SG121TN1%23; Current Rating (Max): 3A; DC Resistance (DCR) (Max): 25mOhm; Impedance @ Frequency: 120 Ohms @ 100 MHz; MPN: BLM18SG121TN1D; Package: 0603
R300 = CRCW06031M00FKEA: RES SMD 1M OHM 1% 1/8W 0603 (1608); Manufacturer: Vishay Dale; Value: 1 MOhms; Voltage: 75V; ComponentLink1Description: Datasheet; ComponentLink1URL: https://www.vishay.com/docs/20035/dcrcwe3.pdf; MPN: CRCW06031M00FKEA; Package: 0603
U300 = XC7Z020-2CLG400I: as U300 on sheet ZHSD-ZYNQ-CONFIG; MPN: XC7Z020-2CLG400I; ComponentLink1Description: Datasheet; ComponentLink1URL: https://docs.amd.com/v/u/en-US/ds190-Zynq-7000-Overview; ComponentLink2Description: DC and AC Switching Characteristics; ComponentLink2URL: https://docs.amd.com/v/u/en-US/ds187-XC7Z010-XC7Z020-Data-Sheet; ComponentLink3Description: PCB Design Guide; ComponentLink3URL: https://docs.amd.com/v/u/en-US/ug933-Zynq-7000-PCB; ComponentLink4Description: Packaging and Pinout; ComponentLink4URL: https://docs.amd.com/v/u/en-US/ug865-Zynq-7000-Pkg-Pinout; ComponentLink5Description: Zynq 7000 SoC Technical Reference Manual; ComponentLink5URL: https://docs.amd.com/r/en-US/ug585-zynq-7000-SoC-TRM

## Sheet ZHSD-BOOT-STORAGE.SchDoc
size A3
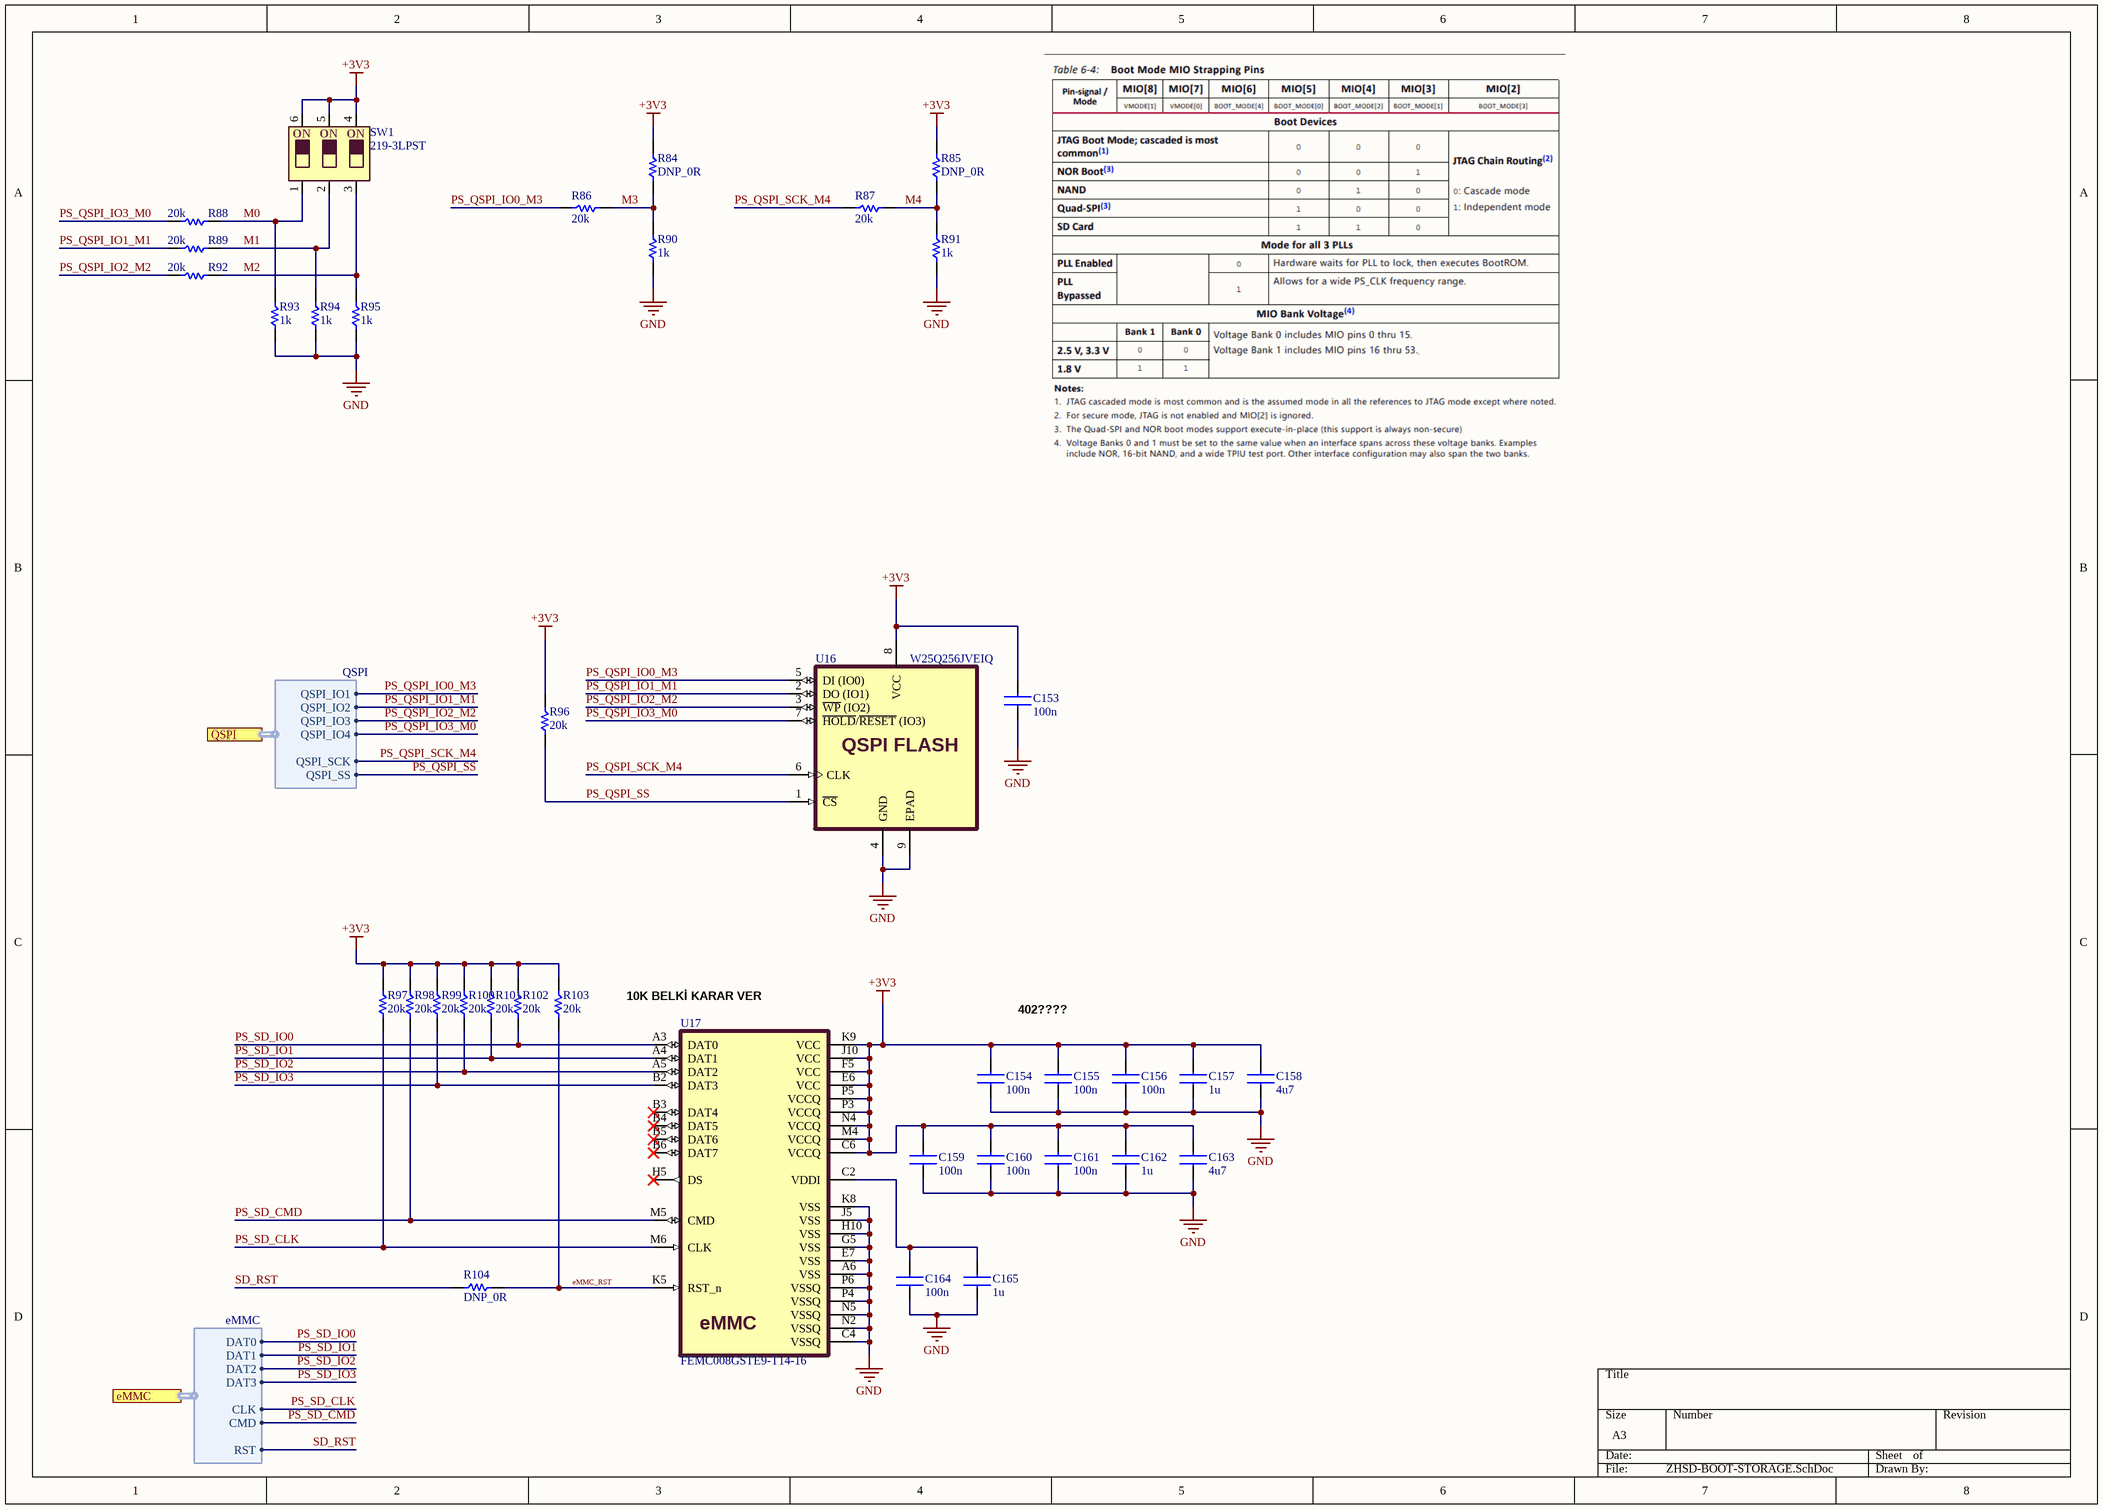
[diagram p4: ZHSD-BOOT-STORAGE.SchDoc]

### Parts
C153  100n  [0603CAPC1608X09N]
C154  100n  [0603CAPC1608X09N]
C155  100n  [0603CAPC1608X09N]
C156  100n  [0603CAPC1608X09N]
C157  1u  [0603CAPC1608X09N]
C158  4u7  [0603CAPC1608X09N]
C159  100n  [0603CAPC1608X09N]
C160  100n  [0603CAPC1608X09N]
C161  100n  [0603CAPC1608X09N]
C162  1u  [0603CAPC1608X09N]
C163  4u7  [0603CAPC1608X09N]
C164  100n  [0603CAPC1608X09N]
C165  1u  [0603CAPC1608X09N]
R84  DNP_0R  [0402RESC1005X04N]
R85  DNP_0R  [0402RESC1005X04N]
R86  20k  [0402RESC1005X04N]
R87  20k  [0402RESC1005X04N]
R88  20k  [0402RESC1005X04N]
R89  20k  [0402RESC1005X04N]
R90  1k  [0402RESC1005X04N]
R91  1k  [0402RESC1005X04N]
R92  20k  [0402RESC1005X04N]
R93  1k  [0402RESC1005X04N]
R94  1k  [0402RESC1005X04N]
R95  1k  [0402RESC1005X04N]
R96  20k  [0402RESC1005X04N]
R97  20k  [0402RESC1005X04N]
R98  20k  [0402RESC1005X04N]
R99  20k  [0402RESC1005X04N]
R100  20k  [0402RESC1005X04N]
R101  20k  [0402RESC1005X04N]
R102  20k  [0402RESC1005X04N]
R103  20k  [0402RESC1005X04N]
R104  DNP_0R  [0402RESC1005X04N]
SW1  219-3LPST  [219-3LPST]
U16  W25Q256JVEIQ  [WSON8X6-SON127P800X80_HS-9N]
U17  FEMC008GSTE9-T14-16  [BGA153C50P14X14_1150X1300X100]

### Ports
eMMC (harness eMMC, see ZHSD-Block[3C], ZHSD-ZYNQ-MIO[4C]), QSPI (harness QSPI, see ZHSD-Block[3C], ZHSD-ZYNQ-MIO[4C])

### Harnesses
eMMC: DAT0, DAT1, DAT2, DAT3, CLK, CMD, RST
QSPI: QSPI_IO1, QSPI_IO2, QSPI_IO3, QSPI_IO4, QSPI_SCK, QSPI_SS

### Nets
+3V3: C153.2 C154.2 C155.2 C156.2 C157.2 C158.2 C159.2 C160.2 C161.2 C162.2 C163.2 R84.2 R85.2 R96.2 R97.2 R98.2 R99.2 R100.2 R101.2 R102.2 R103.2 SW1.4 SW1.5 SW1.6 U16.8(VCC) U17.C6(VCCQ) U17.E6(VCC) U17.F5(VCC) U17.J10(VCC) U17.K9(VCC) U17.M4(VCCQ) U17.N4(VCCQ) U17.P3(VCCQ) U17.P5(VCCQ)
GND: C153.1 C154.1 C155.1 C156.1 C157.1 C158.1 C159.1 C160.1 C161.1 C162.1 C163.1 C164.1 C165.1 R90.1 R91.1 R93.1 R94.1 R95.1 U16.4(GND) U16.9(EPAD) U17.A6(VSS) U17.C4(VSSQ) U17.E7(VSS) U17.G5(VSS) U17.H10(VSS) U17.J5(VSS) U17.K8(VSS) U17.N2(VSSQ) U17.N5(VSSQ) U17.P4(VSSQ) U17.P6(VSSQ)
eMMC_RST: R103.1 R104.2 U17.K5(RST_n)
M0: R88.1 R93.2 SW1.1
M1: R89.1 R94.2 SW1.2
M2: R92.1 R95.2 SW1.3
M3: R84.1 R86.1 R90.2
M4: R85.1 R87.1 R91.2
PS_QSPI_IO0_M3: R86.2 U16.5(DI_(IO0)) ; port QSPI.QSPI_IO1
PS_QSPI_IO1_M1: R89.2 U16.2(DO_(IO1)) ; port QSPI.QSPI_IO2
PS_QSPI_IO2_M2: R92.2 U16.3(~{WP}_(IO2)) ; port QSPI.QSPI_IO3
PS_QSPI_IO3_M0: R88.2 U16.7(~{HOLD}/~{RESET}_(IO3)) ; port QSPI.QSPI_IO4
PS_QSPI_SCK_M4: R87.2 U16.6(CLK) ; port QSPI.QSPI_SCK
PS_QSPI_SS: R96.1 U16.1(~{CS}) ; port QSPI.QSPI_SS
PS_SD_CLK: R97.1 U17.M6(CLK) ; port eMMC.CLK
PS_SD_CMD: R98.1 U17.M5(CMD) ; port eMMC.CMD
PS_SD_IO0: R102.1 U17.A3(DAT0) ; port eMMC.DAT0
PS_SD_IO1: R101.1 U17.A4(DAT1) ; port eMMC.DAT1
PS_SD_IO2: R100.1 U17.A5(DAT2) ; port eMMC.DAT2
PS_SD_IO3: R99.1 U17.B2(DAT3) ; port eMMC.DAT3
SD_RST: R104.1 ; port eMMC.RST
NetC164_2: C164.2 C165.2 U17.C2(VDDI)

Not connected (* = marked no-connect by the designer): U17 B3(DAT4)* B4(DAT5)* B5(DAT6)* B6(DAT7)* H5(DS)*

### Notes on the sheet
- (near U17) 10K BELKİ KARAR VER
- 402????
- (in symbol 219-3LPST) ON
- (in symbol FEMC008GSTE9-T14-16) eMMC
- (in symbol W25Q256JVEIQ) QSPI FLASH

### Library data of the parts
C153-C156 C159-C161 C164 = GRM155R71C104KA88J: as C500 on sheet ZHSD-JTAG; ComponentLink1Description: Datasheet; ComponentLink1URL: https://search.murata.co.jp/Ceramy/image/img/A01X/G101/ENG/GRM155R71C104KA88-01.pdf; MPN: GRM155R71C104KA88J; Package: 0402; Tolerance: ±10%; Voltage: 16V
C157 C162 C165 = GRM188R61E105KA12D: CAP CER 1UF 25V X5R 0603 (1608) ±10%; Manufacturer: Murata Power Solutions Inc.; Value: 1 µF; ComponentLink1Description: Datasheet; ComponentLink1URL: https://search.murata.co.jp/Ceramy/image/img/A01X/G101/ENG/GRM188R61E105KA12-01.pdf; MPN: GRM188R61E105KA12D; Package: 0603; Tolerance: ±10%; Voltage: 25V
C158 C163 = CL10A475KP8NNNC: as C501 on sheet ZHSD-JTAG; ComponentLink1Description: Datasheet; ComponentLink1URL: https://mm.digikey.com/Volume0/opasdata/d220001/medias/docus/609/CL10A475KP8NNNC_Spec.pdf; MPN: CL10A475KP8NNNC; Package: 0603; Tolerance: ±10%; Voltage: 10V
R84 R85 R104 = DNP_RES: DO NOT POPULATE RESISTOR; Manufacturer: ***; Value: ***; ComponentLink1Description: Datasheet; ComponentLink1URL: https://yageogroup.com/content/datasheet/asset/file/PYU-RT_1-TO-0-01_ROHS_L; MPN: ***; Voltage: ***; Tolerance: ***; Package: 0402
R86-R89 R92 R96-R103 = RC0402FR-0720KL: RES 20K OHM 1% 1/16W 0402 (1005); Manufacturer: YAGEO; Value: 20 kOhms; Voltage: 50V; ComponentLink1Description: Datasheet; ComponentLink1URL: https://yageogroup.com/content/datasheet/asset/file/PYU-RT_1-TO-0-01_ROHS_L; MPN: RC0402FR-0720KL; Tolerance: ±1%; Package: 0402
R90 R91 R93-R95 = RC0402JR-071KL: as R404 on sheet ZHSD-ZYNQ-CONFIG; ComponentLink1Description: Datasheet; ComponentLink1URL: https://yageogroup.com/content/datasheet/asset/file/PYU-RT_1-TO-0-01_ROHS_L; MPN: RC0402JR-071KL; Tolerance: ±5%; Package: 0402
SW1 = 219-3LPST: Dip Switch SPST 3 Position Surface Mount Slide (Standard) Actuator 100mA 20VDC; Manufacturer: CTS Electrocomponents; Manufacturer Part Number: 219-3LPST; ComponentLink1Description: Datasheet; ComponentLink1URL: https://www.ctscorp.com/Files/DataSheets/Switches/DIP-Switches/CTS-Switches-DIP-219-Series-Datasheet.pdf
U16 = W25Q256JVEIQ: FLASH - NOR Memory IC 256Mbit SPI - Quad I/O 133 MHz 8-WSON (8x6); Manufacturer: Winbond Electronics; ComponentLink1Description: Datasheet; ComponentLink1URL: https://www.winbond.com/resource-files/w25q256jv%20spi%20revg%2008032017.pdf; MPN: W25Q256JVEIQ
U17 = FEMC008GSTE9-T14-16: FLASH - NAND (MLC) Memory IC 64Gbit eMMC_5.1 200 MHz 153-FBGA (11.5x13); Manufacturer: Flexxon Pte Ltd; ComponentLink1Description: Datasheet; ComponentLink1URL: https://mm.digikey.com/Volume0/opasdata/d220001/medias/docus/6348/FLEXXON%20eMMC%205.1%20MLC%20%28XTRA%20III%20153ball%29%20SPEC%20V1.9.pdf; MPN: FEMC008GSTE9-T14-16

## Sheet ZHSD-ZYNQ-MIO.SchDoc
size A3; DocumentNumber: 8; SheetNumber: 8; SheetTotal: 17; Size: A3
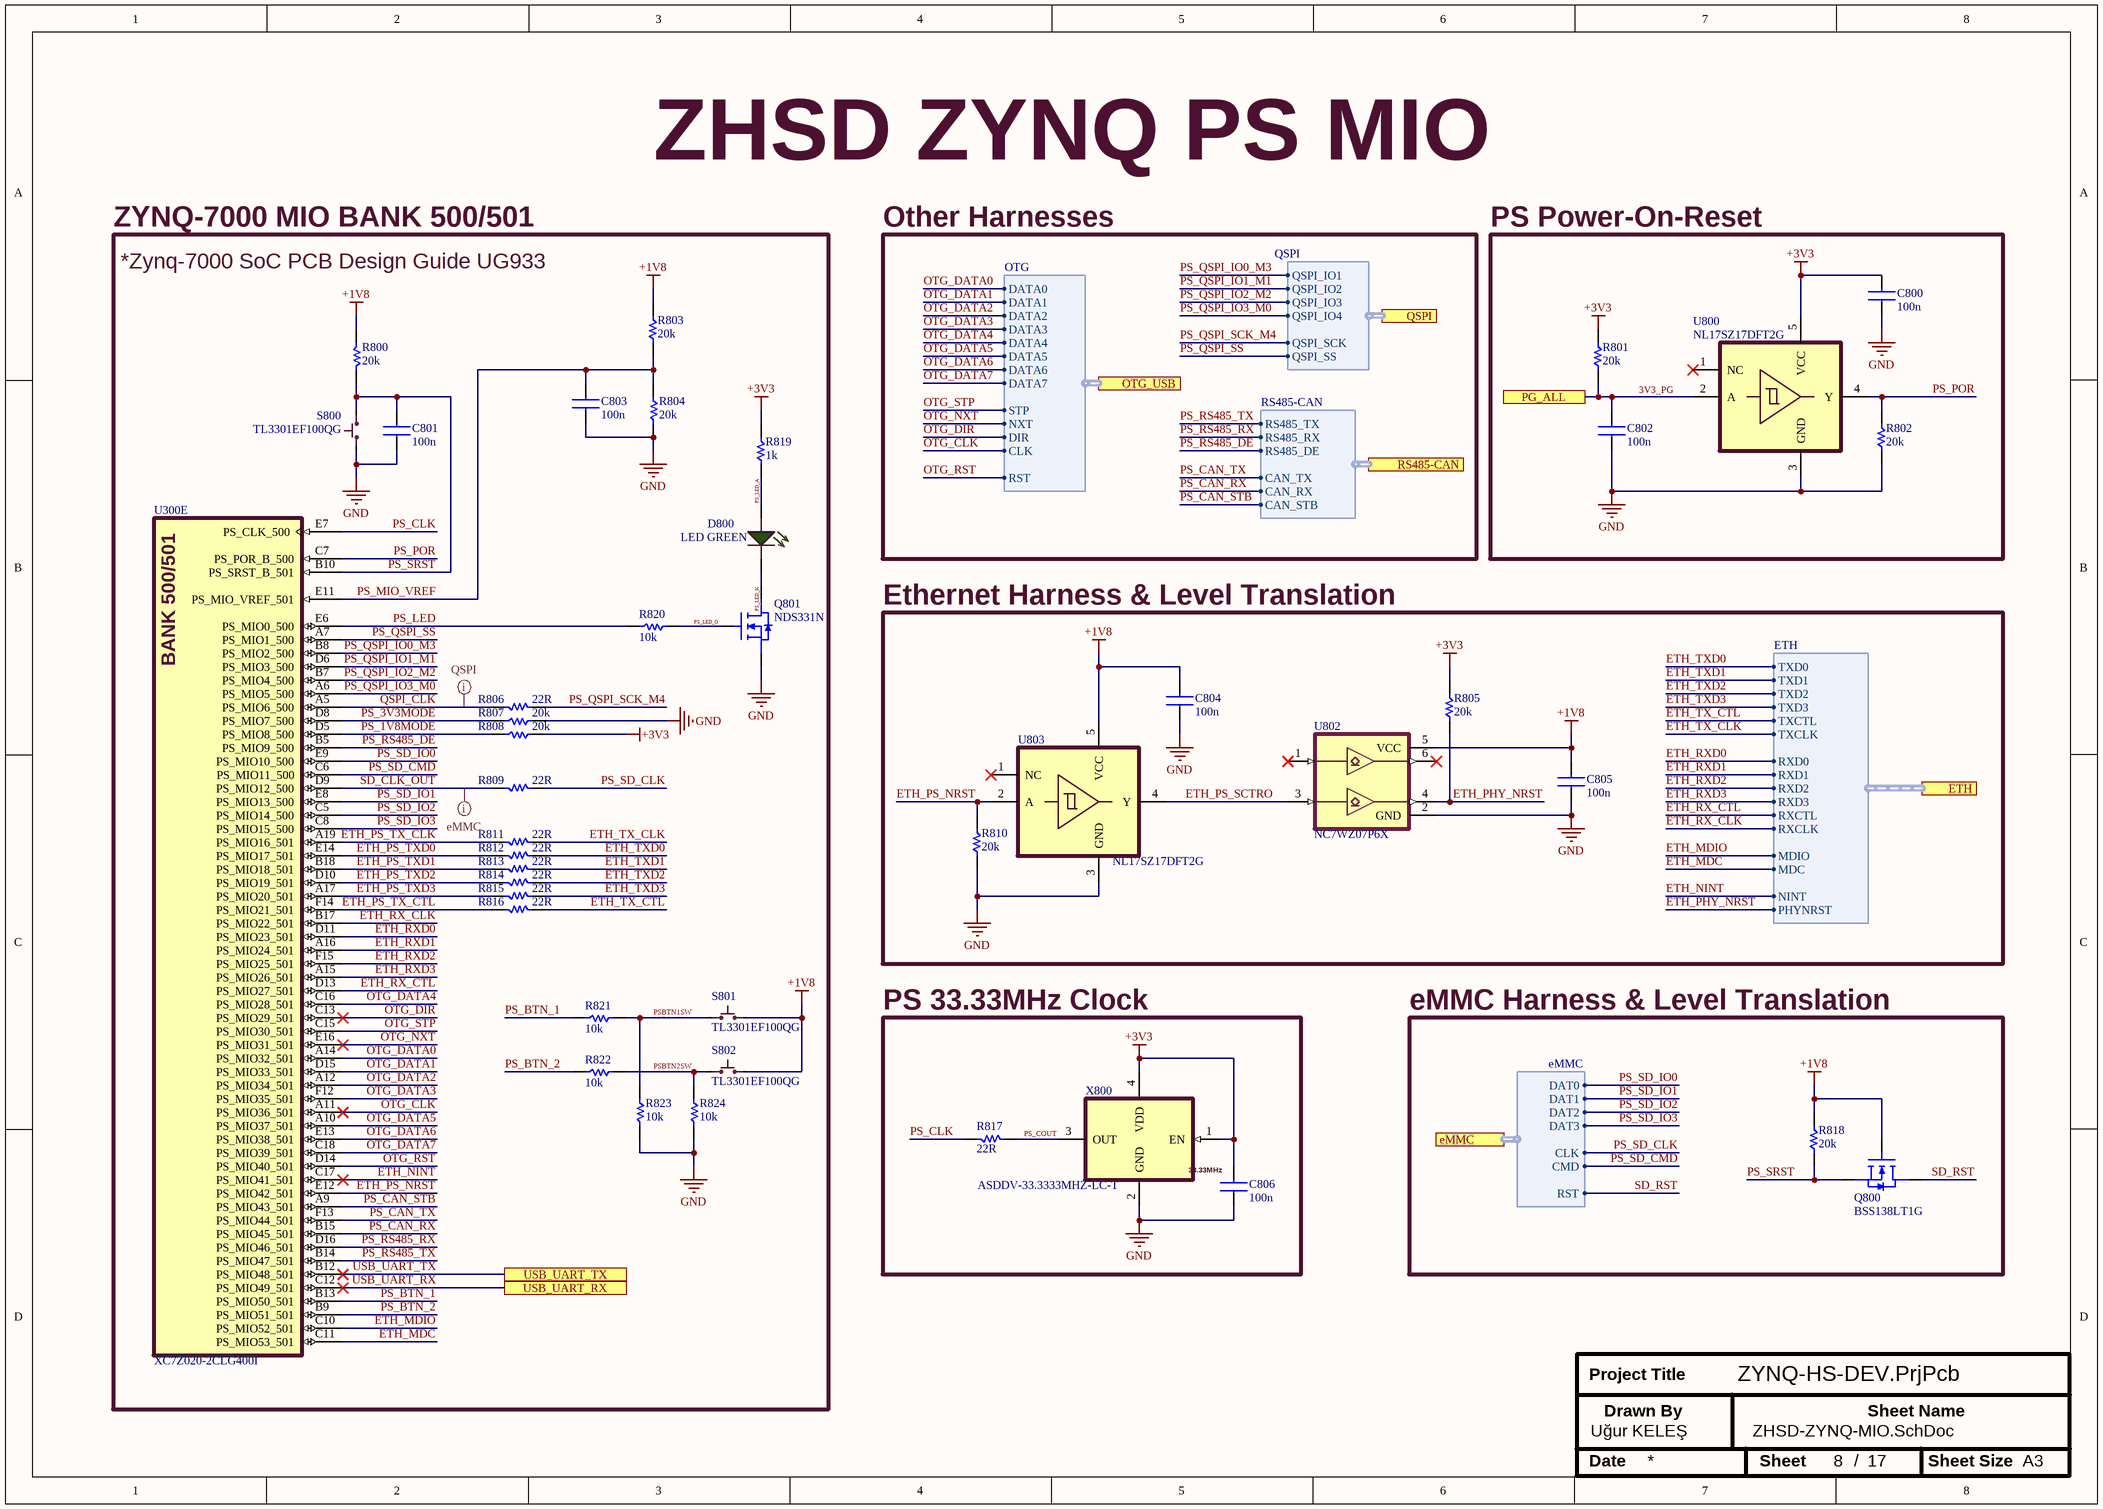
[diagram p5: ZHSD-ZYNQ-MIO.SchDoc]

### Parts
C800  100n  [0603CAPC1608X09N]
C801  100n  [0603CAPC1608X09N]
C802  100n  [0603CAPC1608X09N]
C803  100n  [0603CAPC1608X09N]
C804  100n  [0603CAPC1608X09N]
C805  100n  [0603CAPC1608X09N]
C806  100n  [0603CAPC1608X09N]
D800  LED GREEN  [0603_LED_1608N]
Q800  BSS138LT1G  [SOT95P237X89-3N]
Q801  NDS331N  [SOT95P251X112-3N]
R800  20k  [0402RESC1005X04N]
R801  20k  [0402RESC1005X04N]
R802  20k  [0402RESC1005X04N]
R803  20k  [0402RESC1005X04N]
R804  20k  [0402RESC1005X04N]
R805  20k  [0402RESC1005X04N]
R806  22R  [0603RESC1608X05N]
R807  20k  [0402RESC1005X04N]
R808  20k  [0402RESC1005X04N]
R809  22R  [0603RESC1608X05N]
R810  20k  [0402RESC1005X04N]
R811  22R  [0603RESC1608X05N]
R812  22R  [0603RESC1608X05N]
R813  22R  [0603RESC1608X05N]
R814  22R  [0603RESC1608X05N]
R815  22R  [0603RESC1608X05N]
R816  22R  [0603RESC1608X05N]
R817  22R  [0603RESC1608X05N]
R818  20k  [0402RESC1005X04N]
R819  1k  [0402RESC1005X04N]
R820  10k  [0603RESC1608X05N]
R821  10k  [0603RESC1608X05N]
R822  10k  [0603RESC1608X05N]
R823  10k  [0603RESC1608X05N]
R824  10k  [0603RESC1608X05N]
S800  TL3301EF100QG  [TL3301_Tact_SW]
S801  TL3301EF100QG  [TL3301_Tact_SW]
S802  TL3301EF100QG  [TL3301_Tact_SW]
U300  XC7Z020-2CLG400I  [BGA400C80P20X20_1700X1700X147]  (part E of 8)
U800  NL17SZ17DFT2G  [SOT65P210X110-5N]
U802  NC7WZ07P6X  [NC7WZ07]
U803  NL17SZ17DFT2G  [SOT65P210X110-5N]
X800  ASDDV-33.3333MHZ-LC-T  [XTAL_2520]

### Blocks framed on the sheet
ZYNQ-7000 MIO BANK 500/501: C801 C803 D800 Q801 R800 R803 R804 R806-R809 R811-R816 R819-R824 S800-S802 U300
PS Power-On-Reset: C800 C802 R801 R802 U800
Ethernet Harness & Level Translation: C804 C805 R805 R810 U802 U803
PS 33.33MHz Clock: C806 R817 X800
eMMC Harness & Level Translation: Q800 R818

### Ports
eMMC (harness eMMC, see ZHSD-Block[7500,3700], ZHSD-BOOT-STORAGE[7700,5700]), ETH (harness ETH, see ZHSD-Block[4400,2400], ZHSD-ETHERNET[1700,8000]), OTG_USB (harness OTG, see ZHSD-Block[4400,3700], ZHSD-USB-OTG[1098.545,7100]), PG_ALL (see ZHSD-Block[4400,4800], ZHSD-POWER[1400,1300]), QSPI (harness QSPI, see ZHSD-Block[7500,4400], ZHSD-BOOT-STORAGE[900,3000]), RS485-CAN (harness RS485-CAN, see ZHSD-Block[4400,3000], ZHSD-RS485-CAN[10100,2300]), USB_UART_RX (see ZHSD-Block[4400,4400], ZHSD-USB-UART[9900,3900]), USB_UART_TX (see ZHSD-Block[4400,4600], ZHSD-USB-UART[9900,2200])

### Harnesses
QSPI: QSPI_IO1, QSPI_IO2, QSPI_IO3, QSPI_IO4, QSPI_SCK, QSPI_SS
eMMC: DAT0, DAT1, DAT2, DAT3, CLK, CMD, RST
OTG: DATA0, DATA1, DATA2, DATA3, DATA4, DATA5, DATA6, DATA7, STP, NXT, DIR, CLK, RST
ETH: TXCLK, TXD0, TXD1, TXD2, TXD3, TXCTL, RXCLK, RXD0, RXD1, RXD2, RXD3, RXCTL, MDIO, MDC, NINT, PHYNRST
RS485-CAN: RS485_TX, RS485_RX, RS485_DE, CAN_TX, CAN_RX, CAN_STB

### Nets
+1V8: C804.2 C805.2 Q800.1(G) R800.2 R803.2 R818.2 S801.3,4 S802.3,4 U802.5(VCC) U803.5(VCC)
+3V3: C800.2 C806.2 R801.2 R805.2 R808.1 R819.2 U800.5(VCC) X800.1(EN) X800.4(VDD)
GND: C800.1 C801.1 C802.1 C803.2 C804.1 C805.1 C806.1 Q801.2(S) R802.1 R804.2 R807.1 R810.1 R823.2 R824.2 S800.1,2 U800.3(GND) U802.2(GND) U803.3(GND) X800.2(GND)
3V3_PG: C802.2 R801.1 U800.2(A) ; port PG_ALL
ETH_MDC: U300.C11(PS_MIO53_501) ; port ETH.MDC
ETH_MDIO: U300.C10(PS_MIO52_501) ; port ETH.MDIO
ETH_NINT: U300.C17(PS_MIO41_501) ; port ETH.NINT
ETH_PHY_NRST: R805.1 U802.4(Y2) ; port ETH.PHYNRST
ETH_PS_NRST: R810.2 U300.E12(PS_MIO42_501) U803.2(A)
ETH_PS_SCTRO: U802.3(A2) U803.4(Y)
ETH_PS_TX_CLK: R811.2 U300.A19(PS_MIO16_501)
ETH_PS_TX_CTL: R816.2 U300.F14(PS_MIO21_501)
ETH_PS_TXD0: R812.2 U300.E14(PS_MIO17_501)
ETH_PS_TXD1: R813.2 U300.B18(PS_MIO18_501)
ETH_PS_TXD2: R814.2 U300.D10(PS_MIO19_501)
ETH_PS_TXD3: R815.2 U300.A17(PS_MIO20_501)
ETH_RX_CLK: U300.B17(PS_MIO22_501) ; port ETH.RXCLK
ETH_RX_CTL: U300.D13(PS_MIO27_501) ; port ETH.RXCTL
ETH_RXD0: U300.D11(PS_MIO23_501) ; port ETH.RXD0
ETH_RXD1: U300.A16(PS_MIO24_501) ; port ETH.RXD1
ETH_RXD2: U300.F15(PS_MIO25_501) ; port ETH.RXD2
ETH_RXD3: U300.A15(PS_MIO26_501) ; port ETH.RXD3
ETH_TX_CLK: R811.1 ; port ETH.TXCLK
ETH_TX_CTL: R816.1 ; port ETH.TXCTL
ETH_TXD0: R812.1 ; port ETH.TXD0
ETH_TXD1: R813.1 ; port ETH.TXD1
ETH_TXD2: R814.1 ; port ETH.TXD2
ETH_TXD3: R815.1 ; port ETH.TXD3
OTG_CLK: U300.A11(PS_MIO36_501) ; port OTG_USB.CLK
OTG_DATA0: U300.A14(PS_MIO32_501) ; port OTG_USB.DATA0
OTG_DATA1: U300.D15(PS_MIO33_501) ; port OTG_USB.DATA1
OTG_DATA2: U300.A12(PS_MIO34_501) ; port OTG_USB.DATA2
OTG_DATA3: U300.F12(PS_MIO35_501) ; port OTG_USB.DATA3
OTG_DATA4: U300.C16(PS_MIO28_501) ; port OTG_USB.DATA4
OTG_DATA5: U300.A10(PS_MIO37_501) ; port OTG_USB.DATA5
OTG_DATA6: U300.E13(PS_MIO38_501) ; port OTG_USB.DATA6
OTG_DATA7: U300.C18(PS_MIO39_501) ; port OTG_USB.DATA7
OTG_DIR: U300.C13(PS_MIO29_501) ; port OTG_USB.DIR
OTG_NXT: U300.E16(PS_MIO31_501) ; port OTG_USB.NXT
OTG_RST: U300.D14(PS_MIO40_501) ; port OTG_USB.RST
OTG_STP: U300.C15(PS_MIO30_501) ; port OTG_USB.STP
PS_1V8MODE: R808.2 U300.D5(PS_MIO8_500)
PS_3V3MODE: R807.2 U300.D8(PS_MIO7_500)
PS_BTN_1: R821.2 U300.B13(PS_MIO50_501)
PS_BTN_2: R822.2 U300.B9(PS_MIO51_501)
PS_CAN_RX: U300.B15(PS_MIO45_501) ; port RS485-CAN.CAN_RX  [project net RSCAN.CAN_RX]
PS_CAN_STB: U300.A9(PS_MIO43_501) ; port RS485-CAN.CAN_STB  [project net RSCAN.CAN_STB]
PS_CAN_TX: U300.F13(PS_MIO44_501) ; port RS485-CAN.CAN_TX  [project net RSCAN.CAN_TX]
PS_CLK: R817.2 U300.E7(PS_CLK_500)
PS_COUT: R817.1 X800.3(OUT)
PS_LED: R820.2 U300.E6(PS_MIO0_500)
PS_LED_A: D800.1(A) R819.1
PS_LED_G: Q801.1(G) R820.1
PS_LED_K: D800.2(C) Q801.3(D)
PS_MIO_VREF: C803.1 R803.1 R804.1 U300.E11(PS_MIO_VREF_501)
PS_POR: R802.2 U300.C7(PS_POR_B_500) U800.4(Y)
PS_QSPI_IO0_M3: U300.B8(PS_MIO2_500) ; port QSPI.QSPI_IO1
PS_QSPI_IO1_M1: U300.D6(PS_MIO3_500) ; port QSPI.QSPI_IO2
PS_QSPI_IO2_M2: U300.B7(PS_MIO4_500) ; port QSPI.QSPI_IO3
PS_QSPI_IO3_M0: U300.A6(PS_MIO5_500) ; port QSPI.QSPI_IO4
PS_QSPI_SCK_M4: R806.1 ; port QSPI.QSPI_SCK
PS_QSPI_SS: U300.A7(PS_MIO1_500) ; port QSPI.QSPI_SS
PS_RS485_DE: U300.B5(PS_MIO9_500) ; port RS485-CAN.RS485_DE  [project net RSCAN.RS485_DE]
PS_RS485_RX: U300.D16(PS_MIO46_501) ; port RS485-CAN.RS485_RX  [project net RSCAN.RS485_RX]
PS_RS485_TX: U300.B14(PS_MIO47_501) ; port RS485-CAN.RS485_TX  [project net RSCAN.RS485_TX]
PS_SD_CLK: R809.1 ; port eMMC.CLK
PS_SD_CMD: U300.C6(PS_MIO11_500) ; port eMMC.CMD
PS_SD_IO0: U300.E9(PS_MIO10_500) ; port eMMC.DAT0
PS_SD_IO1: U300.E8(PS_MIO13_500) ; port eMMC.DAT1
PS_SD_IO2: U300.C5(PS_MIO14_500) ; port eMMC.DAT2
PS_SD_IO3: U300.C8(PS_MIO15_500) ; port eMMC.DAT3
PS_SRST: C801.2 Q800.2(S) R800.1 R818.1 S800.3,4 U300.B10(PS_SRST_B_501)
PSBTN1SW: R821.1 R823.1 S801.1,2
PSBTN2SW: R822.1 R824.1 S802.1,2
QSPI_CLK: R806.2 U300.A5(PS_MIO6_500)
SD_CLK_OUT: R809.2 U300.D9(PS_MIO12_500)
SD_RST: Q800.3(D) ; port eMMC.RST
USB_UART_RX: U300.C12(PS_MIO49_501) ; port USB_UART_RX
USB_UART_TX: U300.B12(PS_MIO48_501) ; port USB_UART_TX

Not connected (* = marked no-connect by the designer): U800 1(NC)*; U802 1(A1)* 6(Y1)*; U803 1(NC)*

### Layout directives
net class eMMC; rule Matched Net Lengths [Delay Tolerance = 50ps]: SD_CLK_OUT
rule Matched Net Lengths [Delay Tolerance = 50ps]; net class QSPI: QSPI_CLK

### Notes on the sheet
- ZHSD ZYNQ PS MIO
- Other Harnesses
- *Zynq-7000 SoC PCB Design Guide UG933
- Project Title
- Uğur KELEŞ
- Drawn By
- Sheet Name
- Date
- Sheet
- /
- Sheet Size
- A3
- (in symbol ASDDV-33.3333MHZ-LC-T) 33.33MHz
- (in symbol XC7Z020-2CLG400I, part E) BANK 500/501

### Library data of the parts
C800-C806 = GRM155R71C104KA88J: as C500 on sheet ZHSD-JTAG; ComponentLink1Description: Datasheet; ComponentLink1URL: https://search.murata.co.jp/Ceramy/image/img/A01X/G101/ENG/GRM155R71C104KA88-01.pdf; MPN: GRM155R71C104KA88J; Package: 0402; Tolerance: ±10%; Voltage: 16V
D800 = LTST-C191TGKT: as D400 on sheet ZHSD-ZYNQ-CONFIG; ComponentLink1Description: Datasheet; ComponentLink1URL: https://optoelectronics.liteon.com/upload/download/DS22-2000-300/LTST-C191TGKT.PDF; MPN: LTST-C191TGKT; Package: 0603
Q800 = BSS138LT1G: N-Channel 50 V 200mA (Ta) 225mW (Ta) Surface Mount SOT-23-3 (TO-236); Manufacturer: onsemi; Drain to Source Voltage (Vdss): 50 V; Rds On (Max) @ Id, Vgs: 3.5Ohm @ 200mA, 5V; Vgs (Max): ±20V; ComponentLink1Description: Datasheet; ComponentLink1URL: https://www.onsemi.com/pdf/datasheet/bss138lt1-d.pdf; MPN: BSS138LT1G; Package: SOT-23-3
Q801 = NDS331N: as Q400 on sheet ZHSD-ZYNQ-CONFIG; ComponentLink1Description: Datasheet; ComponentLink1URL: https://www.onsemi.com/pdf/datasheet/nds331n-d.pdf; MPN: NDS331N; Package: SOT-23-3
R800-R805 R807 R808 R810 R818 = RC0402FR-0720KL: as R86 on sheet ZHSD-BOOT-STORAGE; ComponentLink1Description: Datasheet; ComponentLink1URL: https://yageogroup.com/content/datasheet/asset/file/PYU-RT_1-TO-0-01_ROHS_L; MPN: RC0402FR-0720KL; Tolerance: ±1%; Package: 0402
R806 R809 R811-R817 = RC0603FR-0722RL: as R500 on sheet ZHSD-JTAG; ComponentLink1Description: Datasheet; ComponentLink1URL: https://yageogroup.com/content/datasheet/asset/file/PYU-RC_GROUP_51_ROHS_L; MPN: RC0603FR-0722RL; Tolerance: ±1%; Package: 0603
R819 = RC0402JR-071KL: as R404 on sheet ZHSD-ZYNQ-CONFIG; ComponentLink1Description: Datasheet; ComponentLink1URL: https://yageogroup.com/content/datasheet/asset/file/PYU-RT_1-TO-0-01_ROHS_L; MPN: RC0402JR-071KL; Tolerance: ±5%; Package: 0402
R820-R824 = RC0603FR-0710KL: as R400 on sheet ZHSD-ZYNQ-CONFIG; ComponentLink1Description: Datasheet; ComponentLink1URL: https://yageogroup.com/content/datasheet/asset/file/PYU-RC_GROUP_51_ROHS_L; MPN: RC0603FR-0710KL; Tolerance: ±1%; Package: 0603
S800-S802 = TL3301EF100QG: SWITCH TACTILE SPST-NO 0.05A 12V; pin to pad: 1,2>1+2 3,4>3+4; Manufacturer: E-Switch; ComponentLink1Description: Datasheet; ComponentLink1URL: https://configured-product-images.s3.amazonaws.com/Datasheets/TL3301.pdf; MPN: TL3301EF100QG
U300 = XC7Z020-2CLG400I: as U300 on sheet ZHSD-ZYNQ-CONFIG; MPN: XC7Z020-2CLG400I; ComponentLink1Description: Datasheet; ComponentLink1URL: https://docs.amd.com/v/u/en-US/ds190-Zynq-7000-Overview; ComponentLink2Description: DC and AC Switching Characteristics; ComponentLink2URL: https://docs.amd.com/v/u/en-US/ds187-XC7Z010-XC7Z020-Data-Sheet; ComponentLink3Description: PCB Design Guide; ComponentLink3URL: https://docs.amd.com/v/u/en-US/ug933-Zynq-7000-PCB; ComponentLink4Description: Packaging and Pinout; ComponentLink4URL: https://docs.amd.com/v/u/en-US/ug865-Zynq-7000-Pkg-Pinout; ComponentLink5Description: Zynq 7000 SoC Technical Reference Manual; ComponentLink5URL: https://docs.amd.com/r/en-US/ug585-zynq-7000-SoC-TRM
U800 U803 = NL17SZ17DFT2G: IC BUFFER NON-INVERT 5.5V SC-88A; Manufacturer: onsemi; ComponentLink1Description: Datasheet; ComponentLink1URL: https://www.onsemi.com/pdf/datasheet/nl17sz17-d.pdf; MPN: NL17SZ17DFT2G
U802 = NC7WZ07P6X: IC BUFFER NON-INVERT 5.5V SC-88; Manufacturer: onsemi; ComponentLink1Description: Datasheet; ComponentLink1URL: https://www.onsemi.com/pdf/datasheet/nc7wz07-d.pdf; MPN: NC7WZ07P6X
X800 = ASDDV-33.3333MHZ-LC-T: 33.3333 MHz XO (Standard) HCMOS, LVCMOS Oscillator 1.6V ~ 3.6V Enable/Disable 4-SMD, No Lead; Manufacturer: Abracon LLC; ComponentLink1Description: Datasheet; ComponentLink1URL: https://abracon.com/datasheets/ASDDV.pdf; MPN: ASDDV-33.3333MHZ-LC-T

## Sheet ZHSD-USB-OTG.SchDoc
size A3; DocumentNumber: 10; SheetNumber: 10; SheetTotal: 17; Size: A3
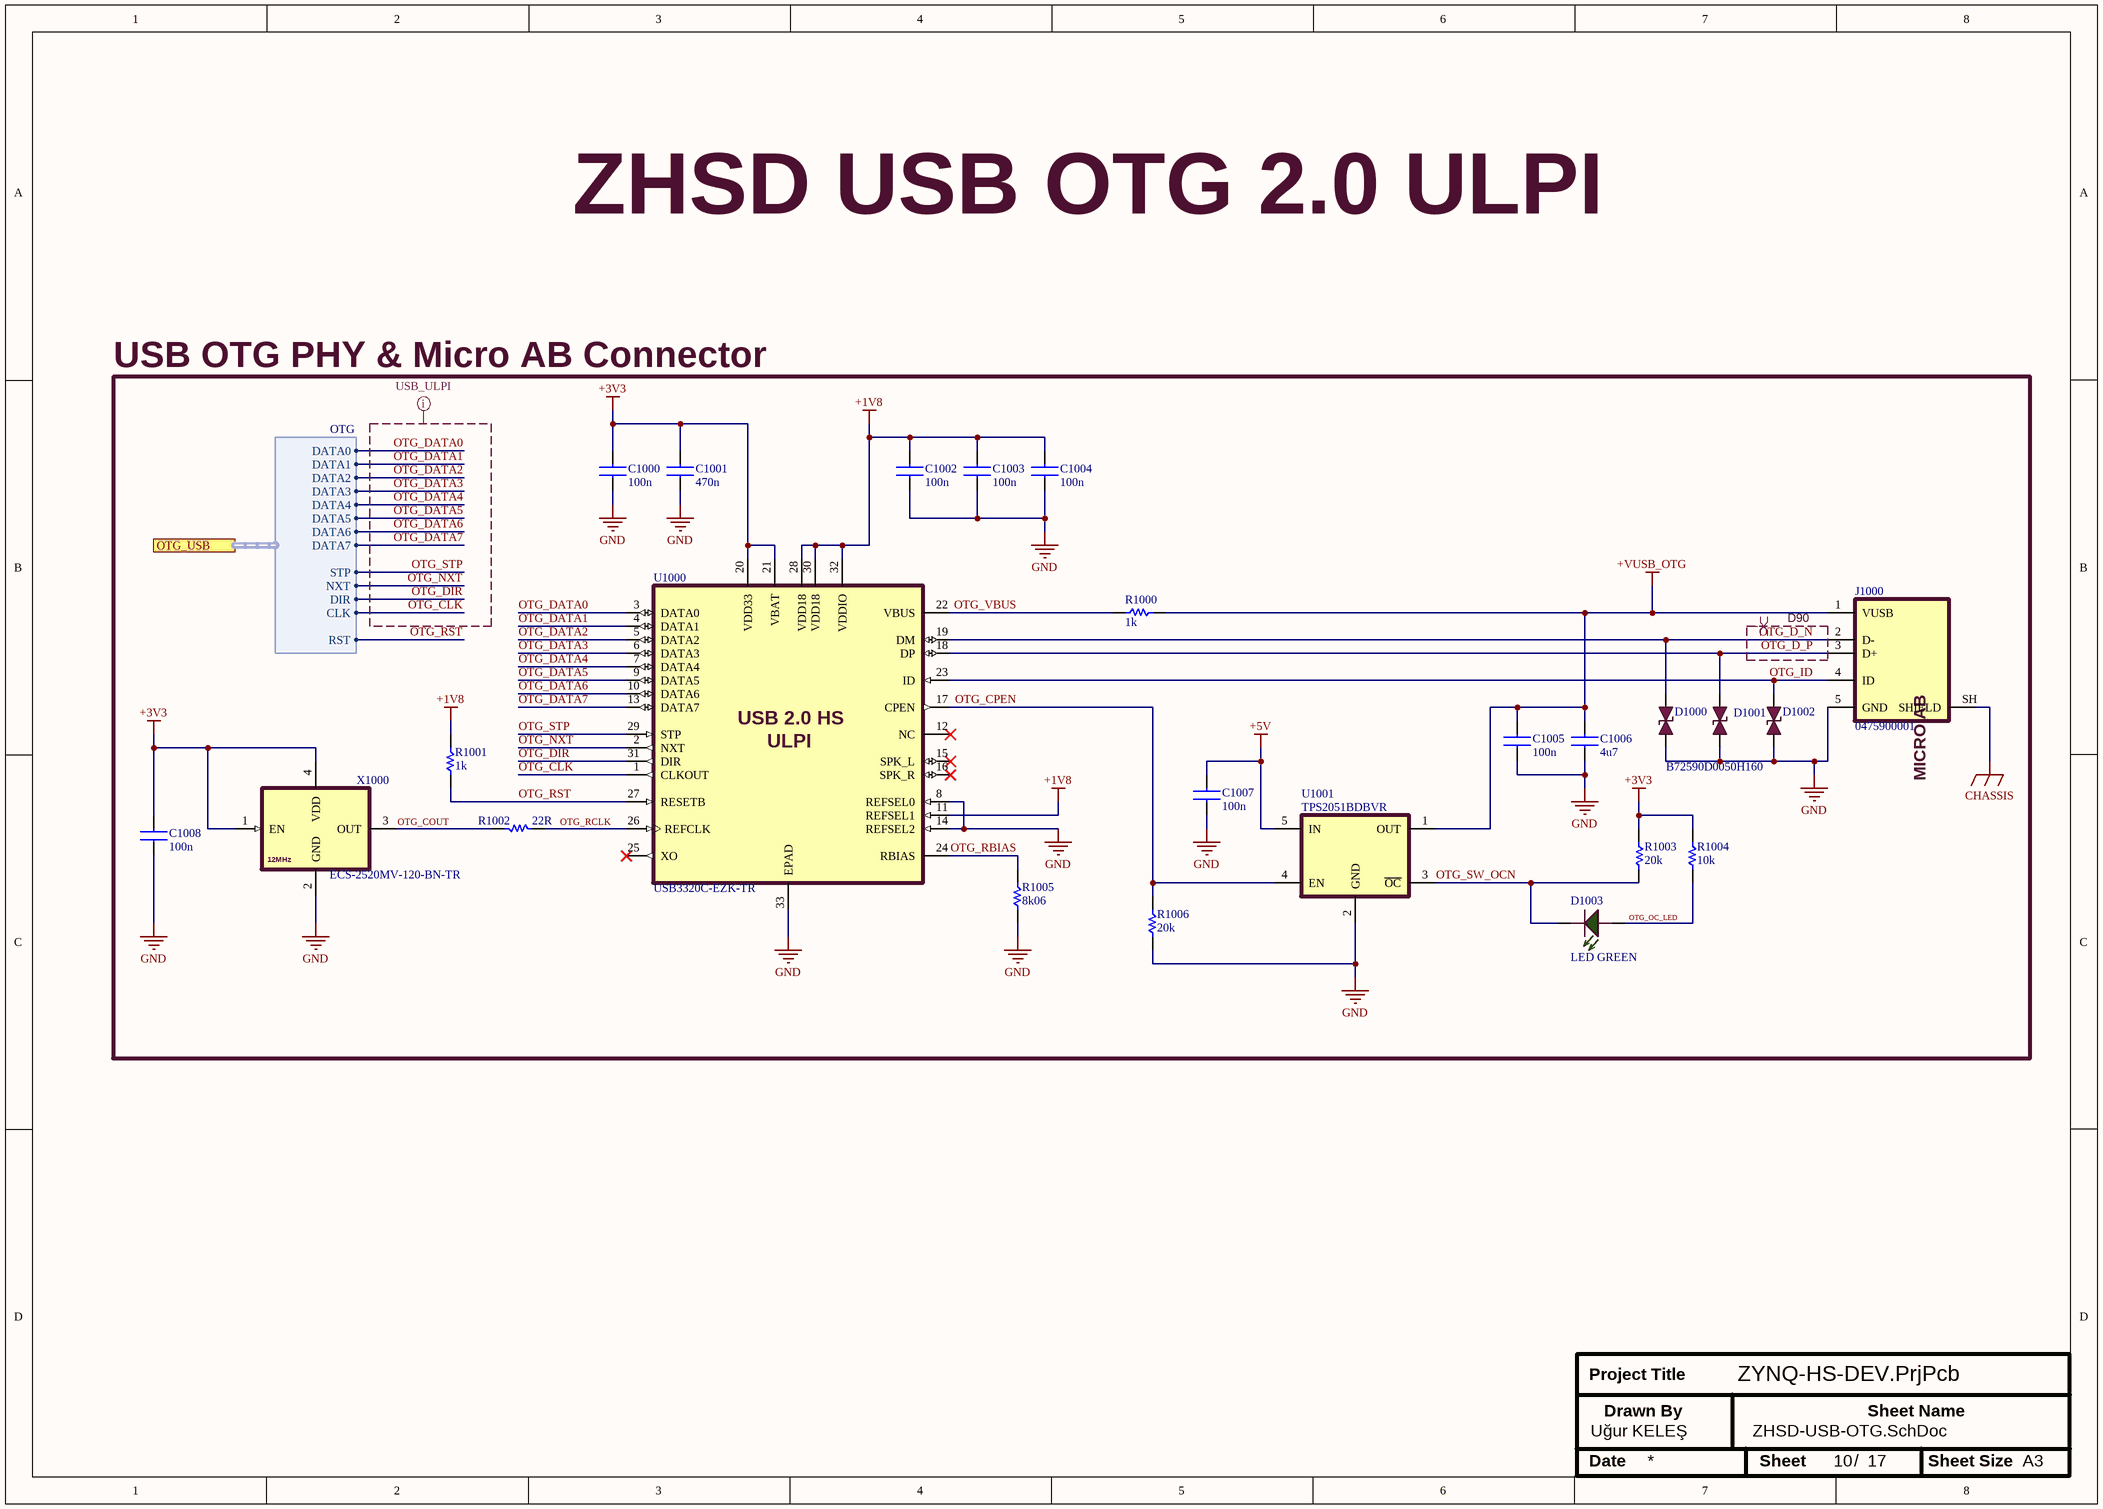
[diagram p6: ZHSD-USB-OTG.SchDoc]

### Parts
C1000  100n  [0603CAPC1608X09N]
C1001  470n  [0402CAPC1005X06N]
C1002  100n  [0603CAPC1608X09N]
C1003  100n  [0603CAPC1608X09N]
C1004  100n  [0603CAPC1608X09N]
C1005  100n  [0603CAPC1608X09N]
C1006  4u7  [0603CAPC1608X09N]
C1007  100n  [0603CAPC1608X09N]
C1008  100n  [0603CAPC1608X09N]
D1000  B72590D0050H160  [0402DIOC1005X06N]  (value not drawn)
D1001  B72590D0050H160  [0402DIOC1005X06N]  (value not drawn)
D1002  B72590D0050H160  [0402DIOC1005X06N]
D1003  LED GREEN  [0603_LED_1608N]
J1000  0475900001  [USB2.0 MICRO AB SMD]
R1000  1k  [0603RESC1608X05N]
R1001  1k  [0603RESC1608X05N]
R1002  22R  [0603RESC1608X05N]
R1003  20k  [0402RESC1005X04N]
R1004  10k  [0603RESC1608X05N]
R1005  8k06  [0402RESC1005X04N]
R1006  20k  [0402RESC1005X04N]
U1000  USB3320C-EZK-TR  [QFN50P500X500X100_HS-33N]
U1001  TPS2051BDBVR  [SOT95P280X125-5N]
X1000  ECS-2520MV-120-BN-TR  [XTAL_2520]

### Blocks framed on the sheet
USB OTG PHY & Micro AB Connector: C1000-C1008 D1000-D1003 J1000 R1000-R1006 U1000 U1001 X1000

### Ports
OTG_USB (harness OTG, see ZHSD-Block[3600,3700], ZHSD-ZYNQ-MIO[8100,8300])

### Harnesses
OTG: DATA0, DATA1, DATA2, DATA3, DATA4, DATA5, DATA6, DATA7, STP, NXT, DIR, CLK, RST

### Nets
+1V8: C1002.2 C1003.2 C1004.2 R1001.2 U1000.11(REFSEL1) U1000.28(VDD18) U1000.30(VDD18) U1000.32(VDDIO)
+3V3: C1000.2 C1001.2 C1008.2 R1003.1 R1004.2 U1000.20(VDD33) U1000.21(VBAT) X1000.1(EN) X1000.4(VDD)
+5V: C1007.2 U1001.5(IN)
+VUSB_OTG: C1005.2 C1006.2 J1000.1(VUSB) R1000.2 U1001.1(OUT)
CHASSIS: J1000.SH(SHIELD)
GND: C1000.1 C1001.1 C1002.1 C1003.1 C1004.1 C1005.1 C1006.1 C1007.1 C1008.1 D1000.1 D1001.1 D1002.1 J1000.5(GND) R1005.1 R1006.1 U1000.8(REFSEL0) U1000.14(REFSEL2) U1000.33(EPAD) U1001.2(GND) X1000.2(GND)
OTG_CLK: U1000.1(CLKOUT) ; port OTG_USB.CLK
OTG_COUT: R1002.2 X1000.3(OUT)
OTG_CPEN: R1006.2 U1000.17(CPEN) U1001.4(EN)
OTG_D_N: D1000.2 J1000.2(D-) U1000.19(DM)
OTG_D_P: D1001.2 J1000.3(D+) U1000.18(DP)
OTG_DATA0: U1000.3(DATA0) ; port OTG_USB.DATA0
OTG_DATA1: U1000.4(DATA1) ; port OTG_USB.DATA1
OTG_DATA2: U1000.5(DATA2) ; port OTG_USB.DATA2
OTG_DATA3: U1000.6(DATA3) ; port OTG_USB.DATA3
OTG_DATA4: U1000.7(DATA4) ; port OTG_USB.DATA4
OTG_DATA5: U1000.9(DATA5) ; port OTG_USB.DATA5
OTG_DATA6: U1000.10(DATA6) ; port OTG_USB.DATA6
OTG_DATA7: U1000.13(DATA7) ; port OTG_USB.DATA7
OTG_DIR: U1000.31(DIR) ; port OTG_USB.DIR
OTG_ID: D1002.2 J1000.4(ID) U1000.23(ID)
OTG_NXT: U1000.2(NXT) ; port OTG_USB.NXT
OTG_OC_LED: D1003.1(A) R1004.1
OTG_RBIAS: R1005.2 U1000.24(RBIAS)
OTG_RCLK: R1002.1 U1000.26(REFCLK)
OTG_RST: R1001.1 U1000.27(RESETB) ; port OTG_USB.RST
OTG_STP: U1000.29(STP) ; port OTG_USB.STP
OTG_SW_OCN: D1003.2(C) R1003.2 U1001.3(~{OC})
OTG_VBUS: R1000.1 U1000.22(VBUS)

Not connected (* = marked no-connect by the designer): U1000 12(NC)* 15(SPK_L)* 16(SPK_R)* 25(XO)*

### Layout directives
differential pair; differential pair class USB; rule Differential Pairs Routing [Pref Gap = 6.299mil    Min Gap  = 5mil    Max Gap  = 7.874milPref Width = 3.937mil    Min Width  = 3.937mil    Max Width  = 4.768mil]; Impedance: D90: OTG_D_N, OTG_D_P
net class USB_ULPI; rule Matched Net Lengths [Delay Tolerance = 10ps]: OTG_CLK, OTG_DATA0, OTG_DATA1, OTG_DATA2, OTG_DATA3, OTG_DATA4, OTG_DATA5, OTG_DATA6, OTG_DATA7, OTG_DIR, OTG_NXT, OTG_STP

### Notes on the sheet
- ZHSD USB OTG 2.0 ULPI
- Project Title
- Uğur KELEŞ
- Drawn By
- Sheet Name
- Date
- Sheet
- /
- Sheet Size
- A3
- (in symbol ECS-2520MV-120-BN-TR) 12MHz
- (in symbol USB3320C-EZK-TR) USB 2.0 HS; ULPI
- (in symbol USB-MICRO-AB) MICRO AB

### Library data of the parts
C1000 C1002-C1005 C1007 = GRM155R71C104KA88J: as C500 on sheet ZHSD-JTAG; ComponentLink1Description: Datasheet; ComponentLink1URL: https://search.murata.co.jp/Ceramy/image/img/A01X/G101/ENG/GRM155R71C104KA88-01.pdf; MPN: GRM155R71C104KA88J; Package: 0402; Tolerance: ±10%; Voltage: 16V
C1001 = GRM155R60J474KE19D: as C300 on sheet ZHSD-ZYNQ-PWR; ComponentLink1Description: Datasheet; ComponentLink1URL: https://search.murata.co.jp/Ceramy/image/img/A01X/G101/ENG/GRM21BR71A475KE51-01.pdf; MPN: GRM155R60J474KE19D; Package: 0402; Tolerance: ±10%; Voltage: 6.3V
C1006 = CL10A475KP8NNNC: as C501 on sheet ZHSD-JTAG; ComponentLink1Description: Datasheet; ComponentLink1URL: https://mm.digikey.com/Volume0/opasdata/d220001/medias/docus/609/CL10A475KP8NNNC_Spec.pdf; MPN: CL10A475KP8NNNC; Package: 0603; Tolerance: ±10%; Voltage: 10V
C1008 = C0603C104K5RACTU: CAP CER 0.1UF 50V X7R 0603 (1608) ±10%; Manufacturer: KEMET; Value: 0.1 µF; ComponentLink1Description: Datasheet; ComponentLink1URL: https://yageogroup.com/content/datasheet/asset/file/KEM_C1002_X7R_SMD; MPN: C0603C104K5RACTU; Package: 0603; Tolerance: ±10%; Voltage: 50V
D1000-D1002 = B72590D0050H160: as D500 on sheet ZHSD-JTAG; ComponentLink1Description: Datasheet; ComponentLink1URL: https://www.tdk-electronics.tdk.com/inf/75/ds/High_speed_series.pdf?ref_disty=digikey; MPN: B72590D0050H160; Package: 0402
D1003 = LTST-C191TGKT: as D400 on sheet ZHSD-ZYNQ-CONFIG; ComponentLink1Description: Datasheet; ComponentLink1URL: https://optoelectronics.liteon.com/upload/download/DS22-2000-300/LTST-C191TGKT.PDF; MPN: LTST-C191TGKT; Package: 0603
J1000 = USB-MICRO-AB: CONN RCPT MICRO USB AB 5P SMD RA; Manufacturer: Molex; ComponentLink1Description: Datasheet; ComponentLink1URL: https://www.molex.com/content/dam/molex/molex-dot-com/products/automated/en-us/salesdrawingpdf/475/47590/475900001_sd.pdf?inline; MPN: 0475900001
R1000 R1001 = RC0603FR-071KL: RES 1K OHM 1% 1/10W 0603 (1608); Manufacturer: YAGEO; Value: 1 kOhms; Voltage: 75V; ComponentLink1Description: Datasheet; ComponentLink1URL: https://yageogroup.com/content/datasheet/asset/file/PYU-RC_GROUP_51_ROHS_L; MPN: RC0603FR-071KL; Tolerance: ±1%; Package: 0603
R1002 = RC0603FR-0722RL: as R500 on sheet ZHSD-JTAG; ComponentLink1Description: Datasheet; ComponentLink1URL: https://yageogroup.com/content/datasheet/asset/file/PYU-RC_GROUP_51_ROHS_L; MPN: RC0603FR-0722RL; Tolerance: ±1%; Package: 0603
R1003 R1006 = RC0402FR-0720KL: as R86 on sheet ZHSD-BOOT-STORAGE; ComponentLink1Description: Datasheet; ComponentLink1URL: https://yageogroup.com/content/datasheet/asset/file/PYU-RT_1-TO-0-01_ROHS_L; MPN: RC0402FR-0720KL; Tolerance: ±1%; Package: 0402
R1004 = RC0603FR-0710KL: as R400 on sheet ZHSD-ZYNQ-CONFIG; ComponentLink1Description: Datasheet; ComponentLink1URL: https://yageogroup.com/content/datasheet/asset/file/PYU-RC_GROUP_51_ROHS_L; MPN: RC0603FR-0710KL; Tolerance: ±1%; Package: 0603
R1005 = RC0402FR-138K06L: RES 8.06K OHM 1% 1/16W 0402 (1005); Manufacturer: YAGEO; Value: 8.06 kOhms; Voltage: 50V; ComponentLink1Description: Datasheet; ComponentLink1URL: https://yageogroup.com/content/datasheet/asset/file/PYU-RT_1-TO-0-01_ROHS_L; MPN: RC0402FR-138K06L; Tolerance: ±1%; Package: 0402
U1000 = USB3320C-EZK-TR: Hi-Speed USB 2.0 ULPI Transceiver; Manufacturer: Microchip; MPN: USB3320C-EZK-TR; ComponentLink1Description: Datasheet; ComponentLink1URL: https://ww1.microchip.com/downloads/aemDocuments/documents/UNG/ProductDocuments/DataSheets/USB3320-Data-Sheet-DS00001792.pdf
U1001 = TPS2051BDBVR: Power Switch/Driver 1:1 N-Channel 500mA SOT-23-5; Manufacturer: Texas Instruments; ComponentLink1Description: Datasheet; ComponentLink1URL: https://www.ti.com/lit/ds/symlink/tps2051b.pdf?ts=1769451796682&ref_url=https%253A%252F%252Fwww.ti.com%252Fproduct%252FTPS2051B; MPN: TPS2051BDBVR
X1000 = ECS-2520MV-120-BN-TR: as X500 on sheet ZHSD-JTAG; ComponentLink1Description: Datasheet; ComponentLink1URL: https://ecsxtal.com/store/pdf/ECS-2520MV.pdf; MPN: ECS-2520MV-120-BN-TR